# Altium project Capstone_SDR_PLUTOV2.PrjPcb (part 1 of 2)
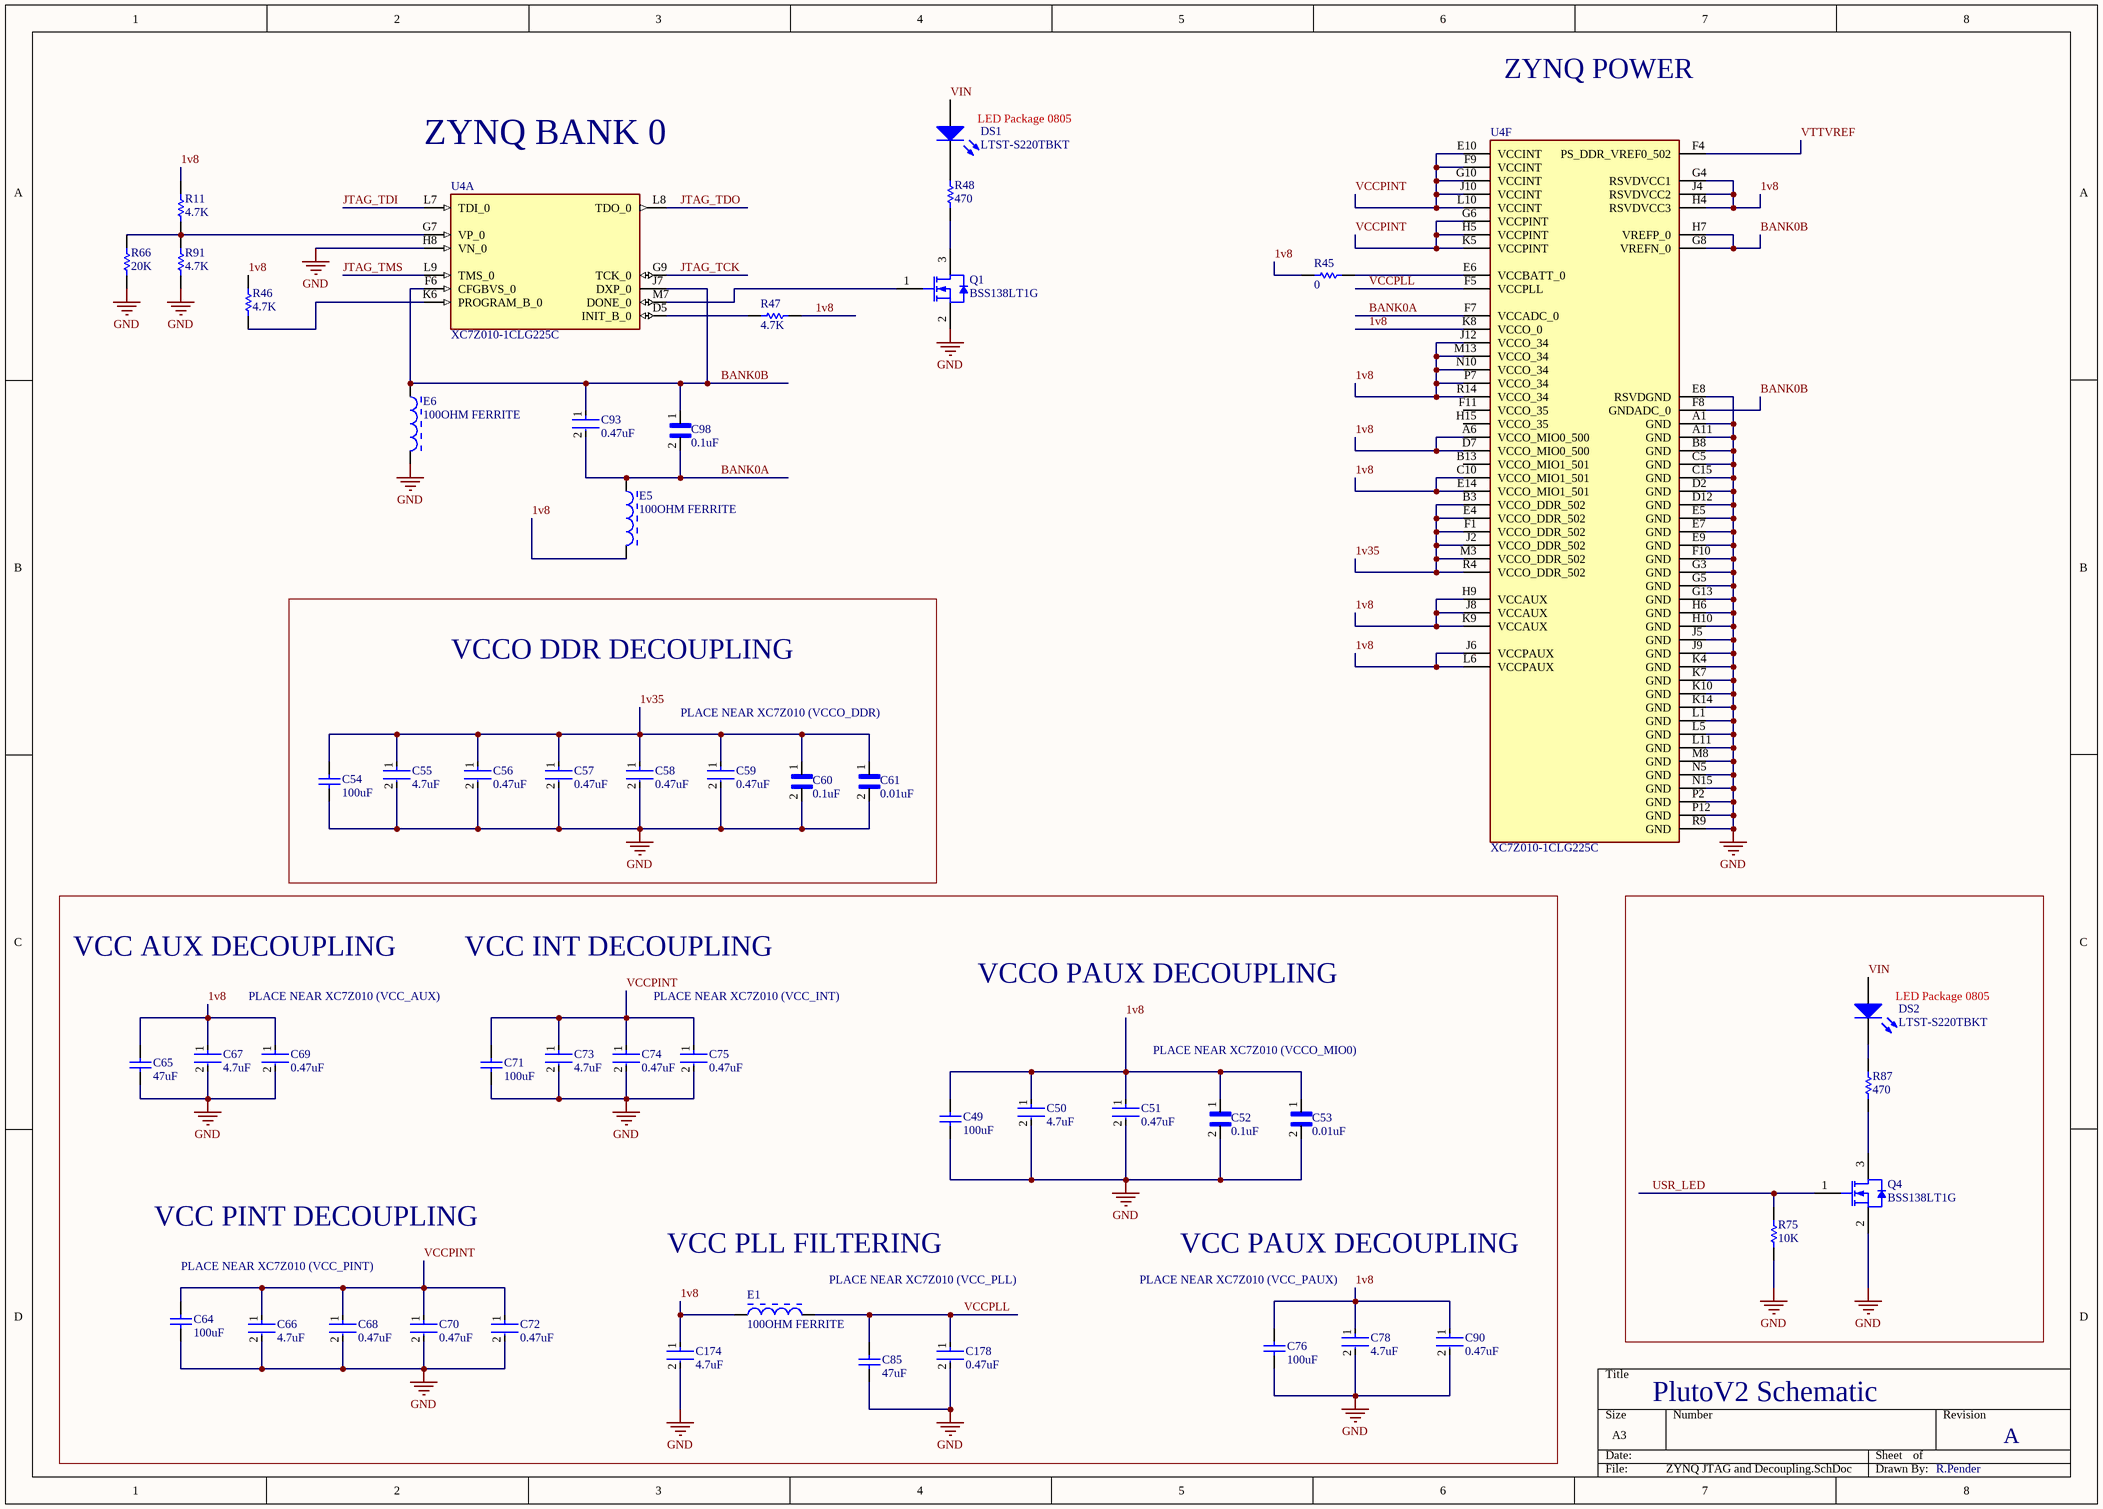
[diagram p0: ZYNQ JTAG and Decoupling.SchDoc]
7 sheets, 240 parts. Net scope: global (net labels, ports and power ports of the same name join across sheets).
Board file: PlutoV2_PCB.PcbDoc
Sheets:
  ZYNQ JTAG and Decoupling.SchDoc
  RF FRONTEND.SchDoc
  CONNECTORS_SELECTORS.SchDoc
  POWERMANAGE.SchDoc
  POWERMANAGE2.SchDoc
  TESTPOINTS.SchDoc
  RF Frontend 2.SchDoc

## Sheet ZYNQ JTAG and Decoupling.SchDoc
size A3; SheetNumber: 4; SheetTotal: 13; SPICEModelCacheIAXUMUHC: <root> / <DocumentId>IAXUMUHC</DocumentId> / <CacheFrame Number="0"> / <Model Name="led3" Kind="MDL"> / <Text>*Typ BLUE SiC LED: Vf=3.4V Vr=5V If=40mA trr=3uS / *LED Pinout: 1=A, 2=K / .MODEL LED3 D (IS=93.1P RS=42M N=7.47 BV=5 IBV=30U / + CJO=2.97P VJ=.75 M=.333 TT=4.32U)</Text> / </Model> / </CacheFrame> / </root>

### Parts
C49  100uF  [CAPC3216X190X55ML30T25]
C50  4.7uF  [FP-C1005-050-0_15-MFG]
C51  0.47uF  [FP-C1005-050-0_15-MFG]
C52  0.1uF  [CAPC0603X33N]
C53  0.01uF  [CAPC0603X33N]
C54  100uF  [CAPC3216X190X55ML30T25]
C55  4.7uF  [FP-C1005-050-0_15-MFG]
C56  0.47uF  [FP-C1005-050-0_15-MFG]
C57  0.47uF  [FP-C1005-050-0_15-MFG]
C58  0.47uF  [FP-C1005-050-0_15-MFG]
C59  0.47uF  [FP-C1005-050-0_15-MFG]
C60  0.1uF  [CAPC0603X33N]
C61  0.01uF  [CAPC0603X33N]
C64  100uF  [CAPC3216X190X55LL30T25]
C65  47uF  [TAYO-JMK212BBJ476MG-T_L]
C66  4.7uF  [FP-C1005-050-0_15-MFG]
C67  4.7uF  [FP-C1005-050-0_15-MFG]
C68  0.47uF  [FP-C1005-050-0_15-MFG]
C69  0.47uF  [FP-C1005-050-0_15-MFG]
C70  0.47uF  [FP-C1005-050-0_15-MFG]
C71  100uF  [CAPC3216X190X55LL30T25]
C72  0.47uF  [FP-C1005-050-0_15-MFG]
C73  4.7uF  [FP-C1005-050-0_15-MFG]
C74  0.47uF  [FP-C1005-050-0_15-MFG]
C75  0.47uF  [FP-C1005-050-0_15-MFG]
C76  100uF  [CAPC3216X190X55LL30T25]
C78  4.7uF  [FP-C1005-050-0_15-MFG]
C85  47uF  [TAYO-JMK212BBJ476MG-T_L]
C90  0.47uF  [FP-C1005-050-0_15-MFG]
C93  0.47uF  [FP-C1005-050-0_15-MFG]
C98  0.1uF  [CAPC0603X33N]
C174  4.7uF  [FP-C1005-050-0_15-MFG]
C178  0.47uF  [FP-C1005-050-0_15-MFG]
DS1  LTST-S220TBKT  [CAPC2012X135N]
DS2  LTST-S220TBKT  [CAPC2012X135N]
E1  100OHM FERRITE  [TDK-MPZ2012S101A-2_V]
E5  100OHM FERRITE  [TDK-MPZ2012S101A-2_V]
E6  100OHM FERRITE  [TDK-MPZ2012S101A-2_V]
Q1  BSS138LT1G  [ONSC-SOT-23-3-318-08_V]
Q4  BSS138LT1G  [ONSC-SOT-23-3-318-08_V]
R11  4.7K  [2-0402]
R45  0  [RESC1005X40X25ML10T10]
R46  4.7K  [2-0402]
R47  4.7K  [2-0402]
R48  470  [2-0402]
R66  20K  [2-0402]
R75  10K  [2-0402]
R87  470  [2-0402]
R91  4.7K  [2-0402]
U4  XC7Z010-1CLG225C  [BGA225C80P15X15_1300X1300X150]  (parts A,F of 6)

### Blocks framed on the sheet
VCCO DDR DECOUPLING: C54-C61
LED Package 0805: DS2 Q4 R75 R87

### Nets
GND: C49.2 C50.2 C51.2 C52.2 C53.2 C54.1 C55.2 C56.2 C57.2 C58.2 C59.2 C60.2 C61.2 C64.1 C65.2 C66.2 C67.2 C68.2 C69.2 C70.2 C71.1 C72.2 C73.2 C74.2 C75.2 C76.2 C78.2 C85.1 C90.2 C174.2 C178.2 E6.2 Q1.2(S) Q4.2(S) R66.2 R75.2 R91.2 U4.A1(GND) U4.A11(GND) U4.B8(GND) U4.C5(GND) U4.C15(GND) U4.D2(GND) U4.D12(GND) U4.E5(GND) U4.E7(GND) U4.E8(RSVDGND) U4.E9(GND) U4.F10(GND) U4.G3(GND) U4.G5(GND) U4.G13(GND) U4.H6(GND) U4.H8(VN_0) U4.H10(GND) U4.J5(GND) U4.J9(GND) U4.K4(GND) U4.K7(GND) U4.K10(GND) U4.K14(GND) U4.L1(GND) U4.L5(GND) U4.L11(GND) U4.M8(GND) U4.N5(GND) U4.N15(GND) U4.P2(GND) U4.P12(GND) U4.R9(GND)
1v8: C49.1 C50.1 C51.1 C52.1 C53.1 C65.1 C67.1 C69.1 C76.1 C78.1 C90.1 C174.1 E1.1 E5.2 R11.1 R45.1 R46.1 R47.1 U4.A6(VCCO_MIO0_500) U4.C10(VCCO_MIO1_501) U4.D7(VCCO_MIO0_500) U4.E14(VCCO_MIO1_501) U4.G4(RSVDVCC1) U4.H4(RSVDVCC3) U4.H9(VCCAUX) U4.J4(RSVDVCC2) U4.J6(VCCPAUX) U4.J8(VCCAUX) U4.J12(VCCO_34) U4.K8(VCCO_0) U4.K9(VCCAUX) U4.L6(VCCPAUX) U4.M13(VCCO_34) U4.N10(VCCO_34) U4.P7(VCCO_34) U4.R14(VCCO_34)
1v35: C54.2 C55.1 C56.1 C57.1 C58.1 C59.1 C60.1 C61.1 U4.B3(VCCO_DDR_502) U4.E4(VCCO_DDR_502) U4.F1(VCCO_DDR_502) U4.J2(VCCO_DDR_502) U4.M3(VCCO_DDR_502) U4.R4(VCCO_DDR_502)
BANK0A: C93.2 C98.2 E5.1 U4.F7(VCCADC_0)
BANK0B: C93.1 C98.1 E6.1 U4.F6(CFGBVS_0) U4.F8(GNDADC_0) U4.G8(VREFN_0) U4.H7(VREFP_0) U4.J7(DXP_0)
JTAG_TCK: U4.G9(TCK_0)
JTAG_TDI: U4.L7(TDI_0)
JTAG_TDO: U4.L8(TDO_0)
JTAG_TMS: U4.L9(TMS_0)
USR_LED: Q4.1(G) R75.1
VCCPINT: C64.2 C66.1 C68.1 C70.1 C71.2 C72.1 C73.1 C74.1 C75.1 U4.E10(VCCINT) U4.F9(VCCINT) U4.G6(VCCPINT) U4.G10(VCCINT) U4.H5(VCCPINT) U4.J10(VCCINT) U4.K5(VCCPINT) U4.L10(VCCINT)
VCCPLL: C85.2 C178.1 E1.2 U4.F5(VCCPLL)
VIN: DS1.1(A) DS2.1(A)
VTTVREF: U4.F4(PS_DDR_VREF0_502)
NetDS1_2: DS1.2(K) R48.1
NetDS2_2: DS2.2(K) R87.1
NetQ1_1: Q1.1(G) U4.M7(DONE_0)
NetQ1_3: Q1.3(D) R48.2
NetQ4_3: Q4.3(D) R87.2
NetR11_2: R11.2 R66.1 R91.1 U4.G7(VP_0)
NetR45_2: R45.2 U4.E6(VCCBATT_0)
NetR46_2: R46.2 U4.K6(PROGRAM_B_0)
NetR47_2: R47.2 U4.D5(INIT_B_0)

Not connected (* = marked no-connect by the designer): U4 B13(VCCO_MIO1_501) F11(VCCO_35) H15(VCCO_35)

### Notes on the sheet
- ZYNQ POWER
- ZYNQ BANK 0
- (near DS1) LED Package 0805
- PLACE NEAR XC7Z010 (VCCO_DDR)
- VCC AUX DECOUPLING
- VCC INT DECOUPLING
- VCCO PAUX DECOUPLING
- PLACE NEAR XC7Z010 (VCC_AUX)
- PLACE NEAR XC7Z010 (VCC_INT)
- PLACE NEAR XC7Z010 (VCCO_MIO0)
- VCC PINT DECOUPLING
- VCC PLL FILTERING
- VCC PAUX DECOUPLING
- PLACE NEAR XC7Z010 (VCC_PINT)
- (near E1) PLACE NEAR XC7Z010 (VCC_PLL)
- PLACE NEAR XC7Z010 (VCC_PAUX)
- PlutoV2 Schematic
- A
- R.Pender

### Library data of the parts
C49 C54 C64 C71 C76 = CMP-1662-00011-2: Chip Capacitor, 100 uF, +/- 20%, 6.3 V, -55 to 85 degC, 1206 (3216 Metric), RoHS, Tape and Reel; PartNumber: GRM31CR60J107ME39L; Case\/Package: 1206; Voltage Rating (DC): 6.3 V; Type (Capacitors): X5R; REACH SVHC: No SVHC; Height: 1.6 mm; Tolerance: 20%; Packaging: Tape and Reel; Mount: Surface Mount; PackageDescription: 2-Pin Surface Mount Device, Body 3.2 x 1.6 mm; ComponentLink1URL: http://www.murata.com/; Pins: 2; ComponentLink2Description: Datasheet; PackageReference: 1206; Width: 1.6 mm; Package Quantity: 2000; Capacitance: 100 uF; Min Operating Temperature: -55 degC; Case Code (Imperial): 1206; Max Operating Temperature: 85 degC; DatasheetVersion: 09/2016; Mounting Technology: Surface Mount; Voltage Rating: 6.3 V; ComponentLink1Description: Manufacturer URL; Radiation Hardening: No; Case Code (Metric): 3216; Length: 3.2 mm; ComponentLink2URL: http://psearch.en.murata.com/capacitor/product/GRM31CR60J107ME39%23.pdf; RoHSCompliant: true
C50 C51 C55-C59 C66-C70 C72-C75 C78 C90 C93 C174 C178 = CMP-2000-05437-2: CAP CER 4.7UF 6.3V X5R 0402; Tolerance: 10%; Dielectric Material: Ceramic; Voltage: 6.3V; Capacitance: 4.7uF; Depth: 0.5mm; Height: 0.5mm; Length: 1mm; Termination: SMD/SMT; RoHS Compliant: Yes; Series: C; Case/Package: 0402; Dielectric: X5R; Lead Free: Lead Free; Mount: Surface Mount; Max Operating Temperature: 85°C; Min Operating Temperature: -55°C
C52 C60 C98 = GRM033R61C104ME84D: CAP 0.1UF 16VDC X5R 20% SMD 0201 PAPER TAPE; Package: None; Price: None; Value: *; MP: GRM033R61C104ME84D; Availability: Unavailable
C53 C61 = GRM033R71A103KA01D: SMD Capacitor X7R(EIA) with Capacitance: 10000pF Tol. 10%. Rated Voltage: 10Vdc; MF: Murata; Package: 0603 Taiyo Yuden; MP: GRM033R71A103KA01D; Value: *; SnapEDA_Link: https://www.snapeda.com/parts/GRM033R71A103KA01D/Murata/view-part/4379446/?ref=snap; Availability: Unavailable; Price: None; Check_prices: https://www.snapeda.com/parts/GRM033R71A103KA01D/Murata/view-part/4379446/?ref=eda
C65 C85 = CMP-2000-06498-1: High Value Multilayer Ceramic Capacitor, 47 uF, +/-20%, 6.3 V, -55 to 85 degC, 2-Pin SMD (0805), RoHS, Tape and Reel; Manufacturer: Taiyo Yuden; PCN Part Number: X5R,X7RDielectrics23/Jan/2008; Kits: 587-1797-KIT-ND-KITCAPCERHICAP0603&0805S; Temperature Coefficient: X5R; Tolerance: ±20%; Online Catalog: MSeries; Other Names: 587-1779-1; Capacitance: 47µF; Voltage - Rated: 6.3V; Catalog Drawings: xMKSeries_0805_1.25; Operating Temperature: -55°C~85°C; Mounting Technology: SurfaceMount; Package Reference: 0805; Features: -; Lead Spacing: -; Lead Style: -; Family: CeramicCapacitors; Size / Dimension: 0.079"Lx0.049"W(2.00mmx1.25mm); Package Description: 2-Pin SMD, Body 2.2 x 1.45 mm; Mounting Type: SurfaceMount,MLCC; Package / Case: 0805(2012Metric); Series: M; Category: Capacitors; Packaging: CutTape(CT); Datasheet Version: 10/2015; Datasheet URL: http://datasheet.octopart.com/JMK212BJ476MG-T-Taiyo-Yuden-datasheet-62109412.pdf; Manufacturer URL: http://www.t-yuden.com/; Ratings: -; Height - Seated (Max): -; Standard Package: 1; Thickness (Max): 0.053"(1.35mm); Applications: GeneralPurpose
DS1 DS2 = LED3: Typical BLUE SiC LED; Published: 8-Jun-2000; LatestRevisionDate: 17-Dec-2003; LatestRevisionNote: PCB Footprint replaced.; DatasheetVersion: 16-Apr-2002; PackageVersion: 16-Apr-2002; PackageReference: 3.5X2.8X1.9; Publisher: Altium Limited; PackageDescription: SM LED; 2 C-Bend Leads; Body 3.5 x 2.8 x 1.9 mm, inc leads (LxWxH typ)
E1 E5 E6 = CMP-2000-05399-1: Chip Bead for Power Line, 100 Ohm, +/- 25%, 4 A, -55 to 125 degC, 0805 (2012 Metric), RoHS, Tape and Reel; Manufacturer: TDK; Maximum DC Resistance: 20mOhms; Test Frequency: 100MHz; Impedance: 100Ohms; Case Width: 1.25mm; Case Length: 2mm; Maximum DC Current: 4A; Case Height: 0.85mm; Package Reference: MPZ2012S101A-2; RoHS: Details; Tolerance: 25%; Operating Temperature Range: -55Cto+125C; Datasheet Version: Jul-13; Dimensions: 1.25mmWx2mmLx0.85mmH; Product: FerriteChipBeads; Termination Style: SMD/SMT; Datasheet URL: http://www.farnell.com/datasheets/1750041.pdf; Factory Pack Quantity: 4000; Brand: TDK; Packaging: Reel; Package Description: 2-Pin Surface Mount Device, Body 2 x 1.25 mm; Product Category: EMIFilterBeads,Chips&Arrays; Manufacturer URL: http://www.tdk.com/; Package / Case: 0805(2012metric)
Q1 Q4 = CMP-1058-00767-1: Power MOSFET, 200 mA, 50 V, N-Channel, 3-Pin SOT-23, Pb-Free, Tape and Reel; Manufacturer: On Semiconductor; PD Max (W): 0.225; Coss Typ (pF): 12; V(BR)DSS Min (V): 50; VGS Max (V): 20; Channel Polarity: N Channel; Configuration: Single; VGS(th) Max (V): 1.5; Ciss Typ (pF): 40; Crss Typ (pF): 3.5; ID Max (A): 0.2; ComponentLink3Description: Package Specification; PackageDescription: 3-Pin Small Outline Transistor, Body 2.92 x 1.3 mm, Pitch 0.95 mm; PackageReference: SOT-23-3-318-08; RoHS: Pb-Free; Mounting Technology: Surface Mount; ComponentLink1Description: Manufacturer URL; ComponentLink2URL: http://www.onsemi.com/pub_link/Collateral/BSS138LT1-D.PDF; ComponentLink2Description: Datasheet; Packing: Tape and Reel; PackageVersion: Rev. AP, 11/2009; PartNumber: BSS138LT1G; Package Type: SOT-23-3; ComponentLink1URL: http://www.onsemi.com/; DatasheetVersion: Rev. 8; ComponentLink3URL: http://www.onsemi.cn/pub_link/Collateral/318-08.PDF
R11 R46 R47 R66 R75 R91 = ERJ2RK: Precision Thick Film Chip Resistor, 10 Ohm to 1M Ohm Range, 1% and 0.5% Tolerance, 0402 Size, 0.063 W; Published: 17-Dec-2003; LatestRevisionDate: 19-Mar-2004; LatestRevisionNote: Silkscreen size reduced.; PackageDocument: Mar-2003; PackageReference: 2-0402; Publisher: Altium Limited; Code_IPC: 1005 [0402]; ComponentLink1Description: Manufacturer Link; ComponentLink1URL: http://www.panasonic.com/industrial/components/resistive_products.htm; ComponentLink2Description: Datasheet; ComponentLink2URL: http://www.panasonic.com/industrial/components/pdf/AOA0000CE2.pdf
R45 = CMP-2002-05896-1: Part Number: MC00625W040210R; Manufacturer: Multicomp
R48 R87 = ERJ2GE: Thick Film Chip Resistor, 1 Ohm to 2.2M Ohm Range, 5% Tolerance, 0402 Size, 0.063 W; Note: If flow soldering, adjust pad width of PCB Footprint to 0.7 - 0.8 times the width of the resistor.; Published: 17-Dec-2003; LatestRevisionDate: 19-Mar-2004; LatestRevisionNote: Silkscreen size reduced.; PackageDocument: Mar-2003; PackageReference: 2-0402; Publisher: Altium Limited; Code_IPC: 1005 [0402]; ComponentLink1Description: Manufacturer Link; ComponentLink1URL: http://www.panasonic.com/industrial/components/resistive_products.htm; ComponentLink2Description: Datasheet; ComponentLink2URL: http://www.panasonic.com/industrial/components/pdf/AOA0000CE1.pdf
U4 = XC7Z010-1CLG225C: Dual ARMÂ® CortexÂ®-A9 MPCoreâ„¢ with CoreSightâ„¢ System On Chip _SOC_ IC ZynqÂ®-7000 Artixâ„¢-7 FPGA, 28K Logic Cells 667MHz 225-CSPBGA _13x13_; MF: Xilinx Inc.; Value: *; SnapEDA_Link: https://www.snapeda.com/parts/XC7Z010-1CLG225C/Xilinx%20Inc./view-part/45778/?ref=snap; Digi-Key_Part_Number: 122-1855-ND; Package: CSPBGA-225 Xilinx; Digi-Key_Purchase_URL: https://www.digikey.by/product-detail/en/xilinx-inc/XC7Z010-1CLG225C/122-1855-ND/3925788?utm_source=snapeda&utm_medium=aggregator&utm_campaign=symbol; MP: XC7Z010-1CLG225C

## Sheet RF FRONTEND.SchDoc
size A3; SheetNumber: 7; SheetTotal: 14
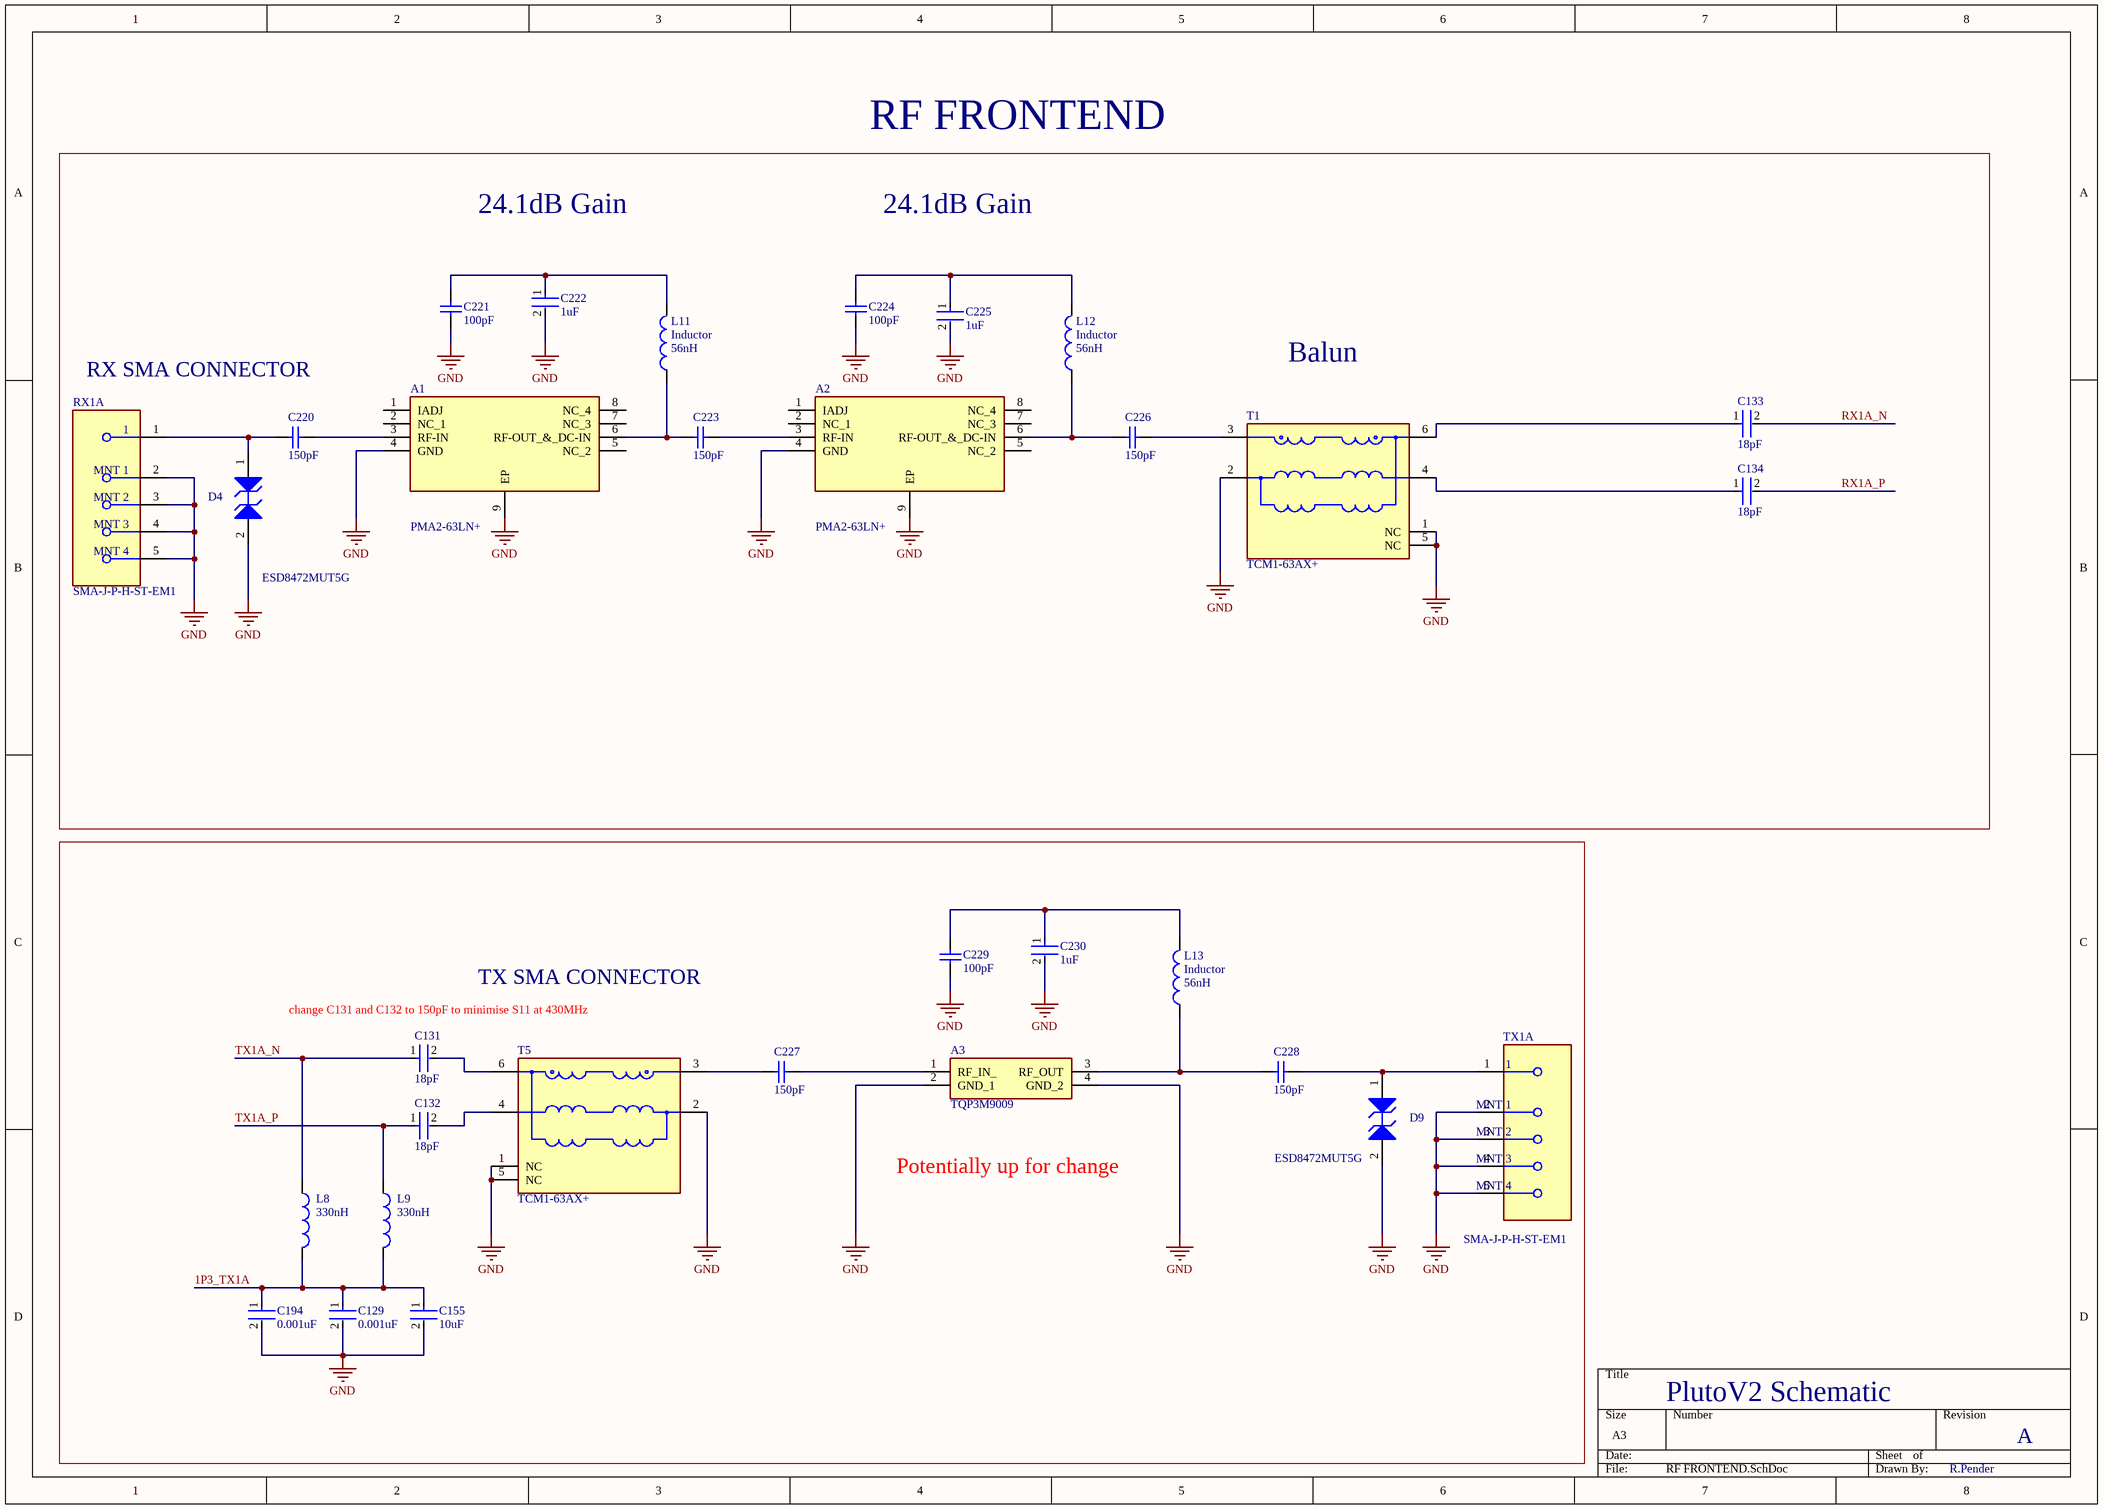
[diagram p1: RF FRONTEND.SchDoc]

### Parts
A1  PMA2-63LN+  [SON50P200X200X105-9N]
A2  PMA2-63LN+  [SON50P200X200X105-9N]
A3  TQP3M9009  [TQP3M9009]
C129  0.001uF  [FP-GRM033-0_03-MFG]
C131  18pF  [FP-GRM033-0_03-IPC_A]
C132  18pF  [FP-GRM033-0_03-IPC_A]
C133  18pF  [FP-GRM033-0_03-IPC_A]
C134  18pF  [FP-GRM033-0_03-IPC_A]
C155  10uF  [FP-GRM188-0_1-e0_2_0_55-IPC_C]
C194  0.001uF  [FP-GRM033-0_03-MFG]
C220  150pF  [CAPC1005X55X25ML05T10]
C221  100pF  [CAPC1005X55X25ML05T10]
C222  1uF  [FP-GRM155-0_05-IPC_B]
C223  150pF  [CAPC1005X55X25ML05T10]
C224  100pF  [CAPC1005X55X25ML05T10]
C225  1uF  [FP-GRM155-0_05-IPC_B]
C226  150pF  [CAPC1005X55X25LL05T10]
C227  150pF  [CAPC1005X55X25LL05T10]
C228  150pF  [CAPC1005X55X25LL05T10]
C229  100pF  [CAPC1005X55X25ML05T10]
C230  1uF  [FP-GRM155-0_05-IPC_B]
D4  ESD8472MUT5G  [ONSC-X3DFN-2-152AF-01_V]
D9  ESD8472MUT5G  [ONSC-X3DFN-2-152AF-01_V]
L8  330nH  [INDC2317X140N]
L9  330nH  [INDC2317X140N]
L11  Inductor  value 56nH  [0402-A]
L12  Inductor  value 56nH  [0402-A]
L13  Inductor  value 56nH  [0402-A]
RX1A  SMA-J-P-H-ST-EM1  [FP-SMA-J-P-H-ST-EM1-MFG]
T1  TCM1-63AX+  [FP-TCM1-63AX+-MFG]
T5  TCM1-63AX+  [FP-TCM1-63AX+-MFG]
TX1A  SMA-J-P-H-ST-EM1  [FP-SMA-J-P-H-ST-EM1-MFG]

### Blocks framed on the sheet
RF FRONTEND: A1 A2 C133 C134 C220-C226 D4 L11 L12 RX1A T1

### Nets
GND: A1.4(GND) A1.9(EP) A2.4(GND) A2.9(EP) A3.2(GND_1) A3.4(GND_2) C129.2 C155.2 C194.2 C221.2 C222.2 C224.2 C225.2 C229.2 C230.2 D4.2(A2) D9.2(A2) RX1A.2(MNT_1) RX1A.3(MNT_2) RX1A.4(MNT_3) RX1A.5(MNT_4) T1.1(NC) T1.2(GND) T1.5(NC) T5.1(NC) T5.2(GND) T5.5(NC) TX1A.2(MNT_1) TX1A.3(MNT_2) TX1A.4(MNT_3) TX1A.5(MNT_4)
1P3_TX1A: C129.1 C155.1 C194.1 L8.2 L9.2  [project net 1P3_SUPPLY_B]
RX1A_N: C133.2
RX1A_P: C134.2
TX1A_N: C131.1 L8.1
TX1A_P: C132.1 L9.1
NetA1_3: A1.3(RF-IN) C220.2
NetA1_6: A1.6(RF-OUT_&_DC-IN) C223.1 L11.1
NetA2_3: A2.3(RF-IN) C223.2
NetA2_6: A2.6(RF-OUT_&_DC-IN) C226.1 L12.1
NetA3_1: A3.1(RF_IN_) C227.2
NetA3_3: A3.3(RF_OUT) C228.1 L13.1
NetC131_2: C131.2 T5.6(SECONDARY_DOT)
NetC132_2: C132.2 T5.4(SECONDARY)
NetC133_1: C133.1 T1.6(SECONDARY_DOT)
NetC134_1: C134.1 T1.4(SECONDARY)
NetC220_1: C220.1 D4.1(A1) RX1A.1
NetC221_1: C221.1 C222.1 L11.2
NetC224_1: C224.1 C225.1 L12.2
NetC226_2: C226.2 T1.3(PRIMARY_DOT)
NetC227_1: C227.1 T5.3(PRIMARY_DOT)
NetC228_2: C228.2 D9.1(A1) TX1A.1
NetC229_1: C229.1 C230.1 L13.2

Not connected (* = marked no-connect by the designer): A1 1(IADJ) 2(NC_1) 5(NC_2) 7(NC_3) 8(NC_4); A2 1(IADJ) 2(NC_1) 5(NC_2) 7(NC_3) 8(NC_4)

### Notes on the sheet
- 24.1dB Gain
- RX SMA CONNECTOR
- Balun
- TX SMA CONNECTOR
- change C131 and C132 to 150pF to minimise S11 at 430MHz
- Potentially up for change
- PlutoV2 Schematic
- A
- R.Pender

### Library data of the parts
A1 A2 = PMA2-63LN+: Integrated Circuit; Manufacturer_Name: Mini-Circuits; Datasheet Link: https://www.minicircuits.com/pdfs/PMA2-63LN+.pdf; Height: 1.05mm; Manufacturer_Part_Number: PMA2-63LN+
A3 = TQP3M9009: Integrated Circuit; Manufacturer_Name: Qorvo; Datasheet Link: https://componentsearchengine.com/Datasheets/1/TQP3M9009.pdf; Height: 1.6mm; Manufacturer_Part_Number: TQP3M9009
C129 C194 = CMP-2010-01706-2: Chip Multilayer Ceramic Capacitors for General Purpose, 0201, 1000pF, X7R, 15%, 10%, 25V; Capacitance: 1nF; Max Operating Temperature: 125°C; Material: Ceramic; Lead Free: Lead Free; Radiation Hardening: No; Dielectric: X7R; Height: 0.3mm; Mount: Surface Mount; Packaging: Tape and Reel; Termination: SMD/SMT; Thickness: 0.013inch; Case Code (Metric): 0603; Tolerance: 10%; Voltage Rating (DC): 25V; REACH SVHC: No SVHC; Package Quantity: 1; Depth: 0.3mm; Voltage: 25V; Case/Package: 0201; Case Code (Imperial): 0201; Voltage Rating: 25V; Min Operating Temperature: -55°C; Length: 0.6mm; Width: 0.012inch
C131-C134 = CMP-2010-01507-2: Chip Multilayer Ceramic Capacitors for General Purpose, 0201, 18pF, C0G, 30ppm/°C, 5%, 50V; Max Operating Temperature: 125°C; Case Code (Metric): 0603; Case Code (Imperial): 0201; Capacitance: 18pF; Voltage Rating (DC): 50V; Lead Free: Lead Free; Mount: Surface Mount; Radiation Hardening: No; Height: 0.3mm; Package Quantity: 15000; Depth: 0.3mm; Tolerance: 5%; Thickness: 0.013inch; Width: 0.3mm; Packaging: Tape and Reel; Voltage Rating: 50V; Dielectric: C0G; Length: 0.6mm; Termination: SMD/SMT; Min Operating Temperature: -55°C; Case/Package: 0201; Voltage: 50V
C155 = CMP-2006-02792-2: Chip Multilayer Ceramic Capacitors for General Purpose, 0603, 10uF, X5R, 15%, 20%, 6.3V; Packaging: Tape and Reel; Voltage Rating (DC): 6.3V; Width: 0.031inch; Termination: SMD/SMT; Dielectric: X5R; Package Quantity: 4000; Voltage Rating: 6.3V; Capacitance: 10uF; Case/Package: 0603; Min Operating Temperature: -55°C; Voltage: 6.3V; Length: 1.6mm; Thickness: 0.035inch; Lead Free: Lead Free; Depth: 0.8mm; Case Code (Imperial): 0603; Max Operating Temperature: 85°C; Material: Ceramic; Height: 0.8mm; Tolerance: 20%; Mount: Surface Mount; REACH SVHC: No SVHC; Radiation Hardening: No; Case Code (Metric): 1608
C220 C223 C226-C228 = CMP-2008-04269-1: Manufacturer: Murata; Part Number: GRM1555C1H151JA01D
C221 C224 C229 = CMP-2008-03915-1: Manufacturer: Murata; Part Number: GRM1555C1H101JA01D
C222 C225 C230 = CMP-2008-04581-2: Chip Multilayer Ceramic Capacitors for General Purpose, 0402, 1.0uF, X5R, 15%, 10%, 25V; Height: 0.5mm; Voltage: 25V; Tolerance: 10%; Termination: SMD/SMT; Dielectric: X5R; REACH SVHC: No SVHC; Case Code (Imperial): 0402; Max Operating Temperature: 85°C; Lead Free: Lead Free; Case/Package: 0402; Mount: Surface Mount; Width: 0.5mm; Weight: 0.000212oz; Min Operating Temperature: -55°C; Voltage Rating (DC): 25V; Length: 1mm; Thickness: 0.022inch; Voltage Rating: 25V; Material: Ceramic; Case Code (Metric): 1005; Package Quantity: 10000; Packaging: Tape and Reel; Depth: 0.5mm; Capacitance: 1uF
D4 D9 = CMP-1063-00281-1: Ultra-Low Capacitance ESD Protection, Micro-Packaged Diode for ESD Protection, 2-Pin X3DFN, Pb-Free, Tape and Reel; Manufacturer: On Semiconductor; IR Max (uA): 0.05; C Max (pF): 0.3; V(BR) Min (V): 7; VRWM Max (V): 5.3; Number of Lines: 1; Direction: Bidirectional; PartNumber: ESD8472MUT5G; PackageVersion: Rev. O, 04/2011; RoHS: Pb-Free; PackageDescription: 2-Pin Small Outline No-Lead, Body 0.62 x 0.32 mm, Pitch 0.355 mm; ComponentLink1Description: Manufacturer URL; ComponentLink1URL: http://www.onsemi.com/; Packing: Tape and Reel; Mounting Technology: Surface Mount; PackageReference: X3DFN-2-152AF-01; ComponentLink3Description: Package Specification; ComponentLink2Description: Datasheet; ComponentLink3URL: http://www.onsemi.cn/pub_link/Collateral/152AF.PDF; DatasheetVersion: Rev. 4; ComponentLink2URL: http://www.onsemi.cn/pub_link/Collateral/ESD8472-D.PDF
L8 L9 = Inductor: Code_IEC: 1005; Value: 10mH; Published: 8-Jun-2000; LatestRevisionDate: 29-May-2009; LatestRevisionNote: IPC-7351 Footprint Added.; PackageReference: 0402-A; Publisher: Altium Limited; PackageDescription: Chip Inductor; Code_JEITA: 0402
L11-L13 = Inductor: Code_IEC: 1005; Published: 8-Jun-2000; LatestRevisionDate: 29-May-2009; LatestRevisionNote: IPC-7351 Footprint Added.; PackageReference: 0402-A; Publisher: Altium Limited; PackageDescription: Chip Inductor; Code_JEITA: 0402
RX1A TX1A = CMP-02754-000006-1: CONN SMA JACK STR 50OHM EDGE MNT; Dielectric Material: PTFE; Center Contact Plating: Gold; Max Frequency: 6GHz; Body Material: Brass; Voltage Rating: 335V; Impedance: 50R; Package Quantity: 1; Case/Package: SMA; Max Operating Temperature: 125°C; Fastening Type: Threaded; Orientation: Straight; Depth: 13.33mm; RoHS Compliant: Yes; Length: 6.35mm; Insulation Material: Polytetrafluoroethylene; Termination: Solder; Min Operating Temperature: -65°C; Housing Color: Gold; Contact Plating: Gold; Contact Material: Copper; Connector Type: SMA; Mount: Edge; Series: SMA; Packaging: Tray; Body Plating: Gold; Radiation Hardening: No
T1 T5 = CMP-199822-000001-1: 1:1 CORE & WIRE Transformer, 10 - 6000 MHz, 50Ω; Manufacturer: Mini-Circuits; Insertion Loss: 1.16-1.8dB; Return Loss: 9.42-16.9dB; Lead Free: Yes; Device Class L3: unset; Temperature: -40°C to +85°C; Manufacturer Part Number: TCM1-63AX+; Frequency: 10-6000MHz; Device Class L2: Transformers; RoHS: TRUE; Octopart: https://octopart.com/tcm1-63ax%2B-mini-circuits-107315723; Temperature Range Low: -40°C; Category: Trans; Package: 0; ComponentLink2URL: https://www.minicircuits.com/pdfs/TCM1-63AX+.pdf; ComponentLink2Description: Datasheet; Automotive: No; Height: 4.06mm; Device Class L1: Passive Components; Temperature Range High: +85°C; Turns Ratio: 1:1

## Sheet CONNECTORS_SELECTORS.SchDoc
size A3; SheetNumber: 8; SheetTotal: 14
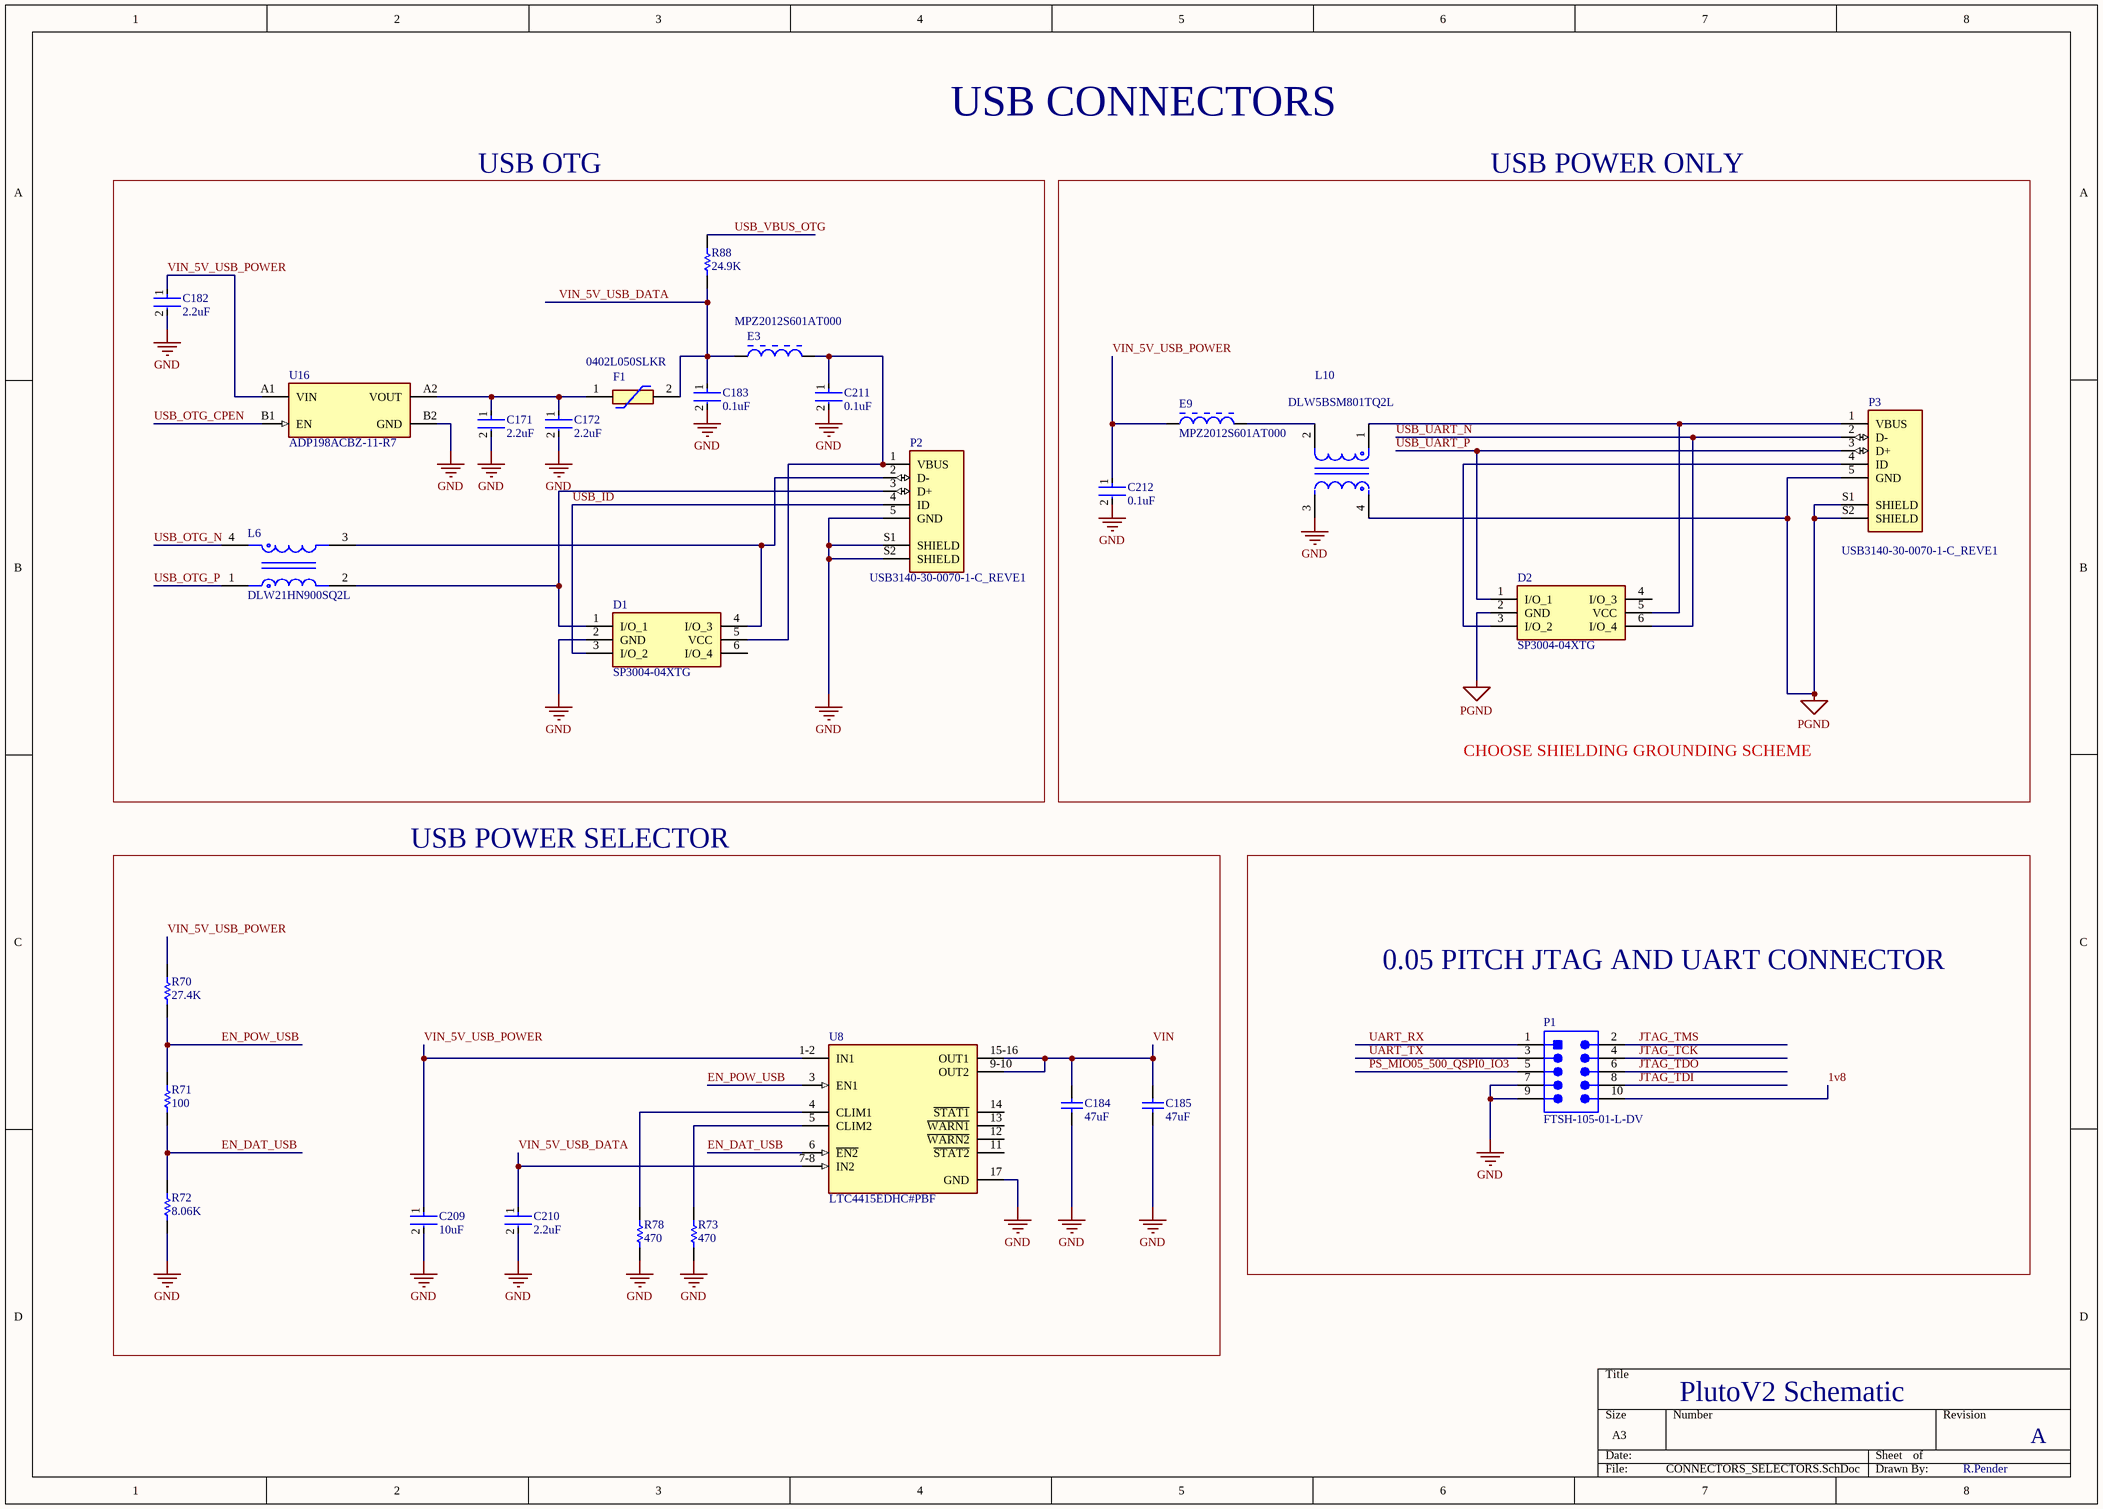
[diagram p2: CONNECTORS_SELECTORS.SchDoc]

### Parts
C171  2.2uF  [FP-GRM188-0_2-IPC_C]
C172  2.2uF  [FP-GRM188-0_2-IPC_C]
C182  2.2uF  [FP-GRM188-0_2-MFG]
C183  0.1uF  [FP-CL10-IPC_A]
C184  47uF  [TAYO-JMK212BBJ476MG-T_L]
C185  47uF  [TAYO-JMK212BBJ476MG-T_L]
C209  10uF  [FP-GRM188-0_15-MFG]
C210  2.2uF  [FP-GRM188-0_2-IPC_C]
C211  0.1uF  [FP-CL10-IPC_A]
C212  0.1uF  [FP-CL10-IPC_A]
D1  SP3004-04XTG  [SOTFL50P160X60-6N]
D2  SP3004-04XTG  [SOTFL50P160X60-6N]
E3  MPZ2012S601AT000  [TDK-MPZ2012_V]
E9  MPZ2012S601AT000  [TDK-MPZ2012_V]
F1  0402L050SLKR  [0402L010SLKR]
L6  DLW21HN900SQ2L  [FP-DLW21HN-MFG]
L10  DLW5BSM801TQ2L  [FP-DLW5BS-MFG]
P1  FTSH-105-01-L-DV  [SMTC-FTSH-105-01-L-DV_V]
P2  USB3140-30-0070-1-C_REVE1  [GCT_USB3140-30-0070-1-C_REVE1]
P3  USB3140-30-0070-1-C_REVE1  [GCT_USB3140-30-0070-1-C_REVE1]
R70  27.4K  [2-0402]
R71  100  [2-0402]
R72  8.06K  [2-0402]
R73  470  [RESC1005X40X25ML05T10]
R78  470  [RESC1005X40X25ML05T10]
R88  24.9K  [2-0402]
U8  LTC4415EDHC#PBF  [FP-DHC-16-05-08-1872-MFG]
U16  ADP198ACBZ-11-R7  [FP-CB-4-4-MFG]

### Blocks framed on the sheet
USB OTG: C171 C172 C182 C183 C211 D1 E3 F1 L6 P2 R88 U16
USB POWER ONLY: C212 D2 E9 L10 P3
USB POWER SELECTOR: C184 C185 C209 C210 R70-R73 R78 U8
0.05 PITCH JTAG AND UART CONNECTOR: P1

### Nets
GND: C171.2 C172.2 C182.2 C183.2 C184.2 C185.2 C209.2 C210.2 C211.2 C212.2 D1.2(GND) L10.3 P1.7 P1.9 P2.5(GND) P2.S1(SHIELD) P2.S2(SHIELD) R72.2 R73.2 R78.2 U8.17(GND) U16.B2(GND)
PGND: D2.2(GND) L10.4 P3.5(GND) P3.S1(SHIELD) P3.S2(SHIELD)
1v8: P1.10
EN_DAT_USB: R71.2 R72.1 U8.6(~{EN2})
EN_POW_USB: R70.2 R71.1 U8.3(EN1)
JTAG_TCK: P1.4
JTAG_TDI: P1.8
JTAG_TDO: P1.6
JTAG_TMS: P1.2
PS_MIO05_500_QSPI0_IO3: P1.5
UART_RX: P1.1
UART_TX: P1.3
USB_ID: D1.3(I/O_2) P2.4(ID)
USB_OTG_CPEN: U16.B1(EN)
USB_OTG_N: L6.4
USB_OTG_P: L6.1
USB_UART_N: D2.6(I/O_4) P3.2(D-)
USB_UART_P: D2.1(I/O_1) P3.3(D+)
USB_VBUS_OTG: R88.2
VIN: C184.1 C185.1 U8.9-10(OUT2) U8.15-16(OUT1)
VIN_5V_USB_DATA: C183.1 C210.1 E3.1 F1.2 R88.1 U8.7-8(IN2)
VIN_5V_USB_POWER: C182.1 C209.1 C212.1 E9.1 R70.1 U8.1-2(IN1) U16.A1(VIN)
NetC171_1: C171.1 C172.1 F1.1 U16.A2(VOUT)
NetC211_1: C211.1 D1.5(VCC) E3.2 P2.1(VBUS)
NetD1_1: D1.1(I/O_1) L6.2 P2.3(D+)
NetD1_4: D1.4(I/O_3) L6.3 P2.2(D-)
NetD2_3: D2.3(I/O_2) P3.4(ID)
NetD2_5: D2.5(VCC) L10.1 P3.1(VBUS)
NetE9_2: E9.2 L10.2
NetR73_1: R73.1 U8.5(CLIM2)
NetR78_1: R78.1 U8.4(CLIM1)

Not connected (* = marked no-connect by the designer): D1 6(I/O_4); D2 4(I/O_3); U8 11(~{STAT2}) 12(~{WARN2}) 13(~{WARN1}) 14(~{STAT1})

### Notes on the sheet
- USB CONNECTORS
- CHOOSE SHIELDING GROUNDING SCHEME
- PlutoV2 Schematic
- A
- R.Pender

### Library data of the parts
C171 C172 C182 C210 = CMP-06035-023692-1: Chip Multilayer Ceramic Capacitors for General Purpose, 0603, 2.2uF, X5R, 15%, 10%, 50V; Mount: Surface Mount; Case/Package: 0603; Voltage Rating (DC): 50V; Weight: 0.000222oz; Capacitance: 2.2uF; Max Operating Temperature: 85°C; Length: 0.063inch; Thickness: 0.039inch; Dielectric: X5R; Min Operating Temperature: -55°C; Termination: SMD/SMT; Resistor Type: Ceramic; Width: 0.8mm; Voltage Rating: 50V; Height: 0.8mm; Tolerance: 10%; Case Code (Metric): 1608; Package Quantity: 10000; Packaging: Tape and Reel; Case Code (Imperial): 0603
C183 C211 C212 = CMP-13271-004036-1: Cap Ceramic 100nF 100V X7R ±10% Pad SMD 0603 +125°C T/R; Mount: Surface Mount; Packaging: Cut Tape; Width: 0.031inch; Thickness: 0.035inch; Length: 0.063inch; Tolerance: 10%; Min Operating Temperature: -55°C; Case/Package: 0603; Voltage Rating: 100V; Max Operating Temperature: 125°C; Case Code (Metric): 1608; Capacitance: 100nF; Case Code (Imperial): 0603
C184 C185 = CMP-2000-06498-1: as C65 on sheet ZYNQ JTAG and Decoupling; Operating Temperature: -55°C~85°C; Mounting Technology: SurfaceMount; Package Reference: 0805; Features: -; Lead Spacing: -; Lead Style: -; Family: CeramicCapacitors; Size / Dimension: 0.079"Lx0.049"W(2.00mmx1.25mm); Package Description: 2-Pin SMD, Body 2.2 x 1.45 mm; Mounting Type: SurfaceMount,MLCC; Package / Case: 0805(2012Metric); Series: M; Category: Capacitors; Packaging: CutTape(CT); Datasheet Version: 10/2015; Datasheet URL: http://datasheet.octopart.com/JMK212BJ476MG-T-Taiyo-Yuden-datasheet-62109412.pdf; Manufacturer URL: http://www.t-yuden.com/; Ratings: -; Height - Seated (Max): -; Standard Package: 1; Thickness (Max): 0.053"(1.35mm); Applications: GeneralPurpose
C209 = CMP-06035-003612-1: Chip Multilayer Ceramic Capacitors for General Purpose, 0603, 10uF, X5R, 15%, 20%, 10V; Tolerance: 20%; Dielectric: X5R; Package Quantity: 4000; Width: 0.8mm; Case/Package: 0603; Thickness: 0.035inch; Capacitance: 10uF; Voltage Rating: 10V; Voltage Rating (DC): 10V; Termination: SMD/SMT; Length: 1.6mm; Lead Free: Lead Free; Mount: Surface Mount; Height: 0.8mm; Depth: 0.8mm; Packaging: Tape and Reel; Weight: 0.000222oz; Min Operating Temperature: -55°C; Case Code (Metric): 1608; Max Operating Temperature: 85°C; Case Code (Imperial): 0603; Material: Ceramic
D1 D2 = SP3004-04XTG: TVS Diode (Uni-directional); Manufacturer_Name: LITTELFUSE; Datasheet Link: https://m.littelfuse.com/~/media/electronics/datasheets/tvs_diode_arrays/littelfuse_tvs_diode_array_sp3004_datasheet.pdf.pdf; Height: 0.6mm; Manufacturer_Part_Number: SP3004-04XTG
E3 E9 = CMP-2000-05401-1: Chip Bead, 0.1 Ohm, 2 A, -55 to 125 degC, 2-Pin SMD (0805), RoHS, Tape and Reel; PCN Part Number: MMZ,MPSSeriesOct/2014; Manufacturer: TDK; Impedance @ Frequency: 600Ohm@100MHz; Other Names: 445-2206-6; Catalog Drawings: (MMZ,MPZ)2012SeriesTop / (MMZ,MPZ)2012SeriesFootprint / (MMZ,MPZ)2012SeriesSide; DC Resistance (DCR): 100mOhmMax; Current Rating: 2A; Product Training Modules: EMCComponents; Filter Type: DifferentialMode-Single; Online Catalog: MPZ2012Series; Datasheet URL: http://datasheet.octopart.com/MPZ2012S601AT000-TDK-datasheet-12512619.pdf; Size / Dimension: 0.079"Lx0.049"W(2.00mmx1.25mm); Package Reference: 805; Package / Case: 0805(2012Metric); Packaging: Digi-Reel; Mounting Type: SurfaceMount; Family: FerriteBeadsandChips; Category: Filters; Height (Max): 0.041"(1.05mm); Datasheet Version: Sep-12; Manufacturer URL: http://www.tdk.com/; Series: MPZ; Package Description: 2-Pin Surface Mount Device, Body 2 x 1.25 mm; Standard Package: 1
F1 = 0402L050SLKR: Resettable Fuse; Manufacturer_Name: LITTELFUSE; Datasheet Link: https://g.componentsearchengine.com/Datasheets/1/0402L010SLKR.pdf; Height: 0.6mm; Manufacturer_Part_Number: 0402L050SLKR
L6 = CMP-06045-000050-1: CMC 330MA 2LN 90 OHM SMD; Tolerance: 25%; Frequency: 100MHz; Shielding: Unshielded; Impedance: 90R; Number of Lines: 2; DC Resistance (DCR): 350mR; Voltage Rating: 50V; DC Current: 330mA; Current Rating: 330mA; Lead Free: Lead Free; Length: 2mm; Radiation Hardening: No; Max Operating Temperature: 85°C; Depth: 1.2mm; Weight: 0.000317oz; Height: 0.9mm; Termination: SMD/SMT; Min Operating Temperature: -40°C; Case/Package: 0805; Packaging: Tape and Reel; Width: 0.047inch; Test Frequency: 100MHz; Mount: Surface Mount; Current: 330mA; Military Standard: Not; Package Quantity: 1; Resistor Type: Wirewound; Case Code (Imperial): 0805; Max DC Current: 330mA
L10 = CMP-06045-000287-1: Common Mode Choke, 2020, 800Ω @ 100MHz, 0.056Ω, 40%, 2A; Number of Lines: 2; Impedance: 800R; DC Resistance (DCR): 56mR; Voltage Rating (DC): 50V; Tolerance: 40%; Package Quantity: 400; Max Current Rating: 2A; Termination: Wire; Max Operating Temperature: 105°C; Height: 0.197inch; Width: 5mm; Mount: Surface Mount; Case/Package: 2020; Weight: 0.010582oz; Length: 5mm; Max DC Current: 2A; Min Operating Temperature: -40°C; Packaging: Tape and Reel
P1 = CMP-2000-05354-1: Male Header, Pitch 1.27 mm, 2 x 5 Position, Height 5.96 mm, -55 to 125 degC, RoHS, Bulk; Manufacturer: Samtec; Connector Type: Header,Unshrouded; Pitch: 0.050"(1.27mm); Mating Products: FLE-105-01-G-DV-TR-ND-CONNSKT1.27MM10POSDUALSMDCLP-105-02-G-D-P-TR-ND-CONNRCPT10POSDUAL.05"SMDSFMC-105-L2-S-D-TR-ND-CONN.05"SURFACE10POSSMTSFMH-105-02-L-D-TR-ND-CONNRECEPT10POS.50"SMTFLE-105-01-G-DV-A-ND-CONNSKT1.27MM10POSDUALSMDCLP-105-02-G-D-BE-ND-CONNRCPT10POSDUAL.05"SMDFLE-105-01-G-DV-A-P-ND-CONNSKT1.27MM10POSDUALSMDSAM1153-05-ND-CONNRCPT10POSDUAL.05"SMDSAM1155-05-ND-CONNRCPT10POSDUAL.05"SMDSAM1154-05-ND-CONNRCPT10POSDUAL.05"SMDSFMH-105-02-L-D-LC-ND-CONNRECEPT10POS.50"SMTSAM1226-05-ND-CONNRCPT.05"10POSDUALSMD; Catalog Drawings: FTSHSeriesFTSHSeriesSMTSide; Other Names: SAM1161-05; EDA / CAD Models: DownloadfromAcceleratedDesigns; Number of Positions Loaded: All; Number of Positions: 10; Featured Product: Board-To-BoardInterconnectSystems; Online Catalog: FTSHSeries; Product Training Modules: Board-to-BoardConnectors; Category: Connectors,Interconnects; Number of Rows: 2; Contact Finish: Gold; Termination: Solder; Mounting Type: SurfaceMount; Series: FTSH; Contact Mating Length: 0.120"(3.05mm); Row Spacing: 0.050"(1.27mm); Datasheet URL: https://datasheet.ciiva.com/30493/0900766b80adfe36-30493006.pdf; Contact Finish Thickness: 10µin(0.25µm); Features: -; Standard Package: 1; Packaging: Bulk; Datasheet Version: Feb-08; Manufacturer URL: http://www.samtec.com/; Fastening Type: -; Family: RectangularConnectors-Headers,MalePins; Contact Type: MalePin; Color: Black
P2 P3 = USB3140-30-0070-1-C_REVE1: USB-micro B Ñ€Ð°Ð·ÑŠÐµÐ¼ Ñ€Ð¾Ð·ÐµÑ‚ÐºÐ¸ USB 2.0 5-Ð¿Ð¾Ð·Ð¸Ñ†Ð¸Ð¾Ð½Ð½Ð¾Ðµ Ð¿Ð¾Ð²ÐµÑ€Ñ…Ð½Ð¾ÑÑ‚Ð½Ð¾Ðµ ÐºÑ€ÐµÐ¿Ð»ÐµÐ½Ð¸Ðµ, ÑÐºÐ²Ð¾Ð·Ð½Ð¾Ðµ Ð¾Ñ‚Ð²ÐµÑ€ÑÑ‚Ð¸Ðµ; MF: Global Connector Technology; SnapEDA_Link: https://www.snapeda.com/parts/USB3140-30-0070-1-C/Global%20Connector%20Technology/view-part/697013/?ref=snap; Availability: Warning; Price: None; Package: None; Check_prices: https://www.snapeda.com/parts/USB3140-30-0070-1-C/Global%20Connector%20Technology/view-part/697013/?ref=eda; Purchase-URL: https://pricing.snapeda.com/search/part/USB3140-30-0070-1-C/?ref=eda; Value: *; MP: USB3140-30-0070-1-C
R70-R72 R88 = ERJ2RK: as R11 on sheet ZYNQ JTAG and Decoupling; Published: 17-Dec-2003; LatestRevisionDate: 19-Mar-2004; LatestRevisionNote: Silkscreen size reduced.; PackageDocument: Mar-2003; PackageReference: 2-0402; Publisher: Altium Limited; Code_IPC: 1005 [0402]; ComponentLink1Description: Manufacturer Link; ComponentLink1URL: http://www.panasonic.com/industrial/components/resistive_products.htm; ComponentLink2Description: Datasheet; ComponentLink2URL: http://www.panasonic.com/industrial/components/pdf/AOA0000CE2.pdf
R73 R78 = CMP-2002-07697-1: Part Number: RC0402FR-07470RL; Manufacturer: Yageo / Phycomp
U8 = CMP-0479-00072-2: IC OR CTRLR SRC SELECT 16DFN; Max Output Current: 4A; Operating Supply Current: 44uA; Packaging: Rail/Tube; Max Operating Temperature: 125°C; Min Operating Temperature: -40°C; Number of Pins: 16; Length: 5mm; Package Quantity: 73; Radiation Hardening: No; Series: PowerPath™; RoHS Compliant: Yes; Case/Package: DFN EP; Lead Free: Lead Free
U16 = CMP-09134-000005-1: IC PWR SWITCH P-CHAN 1:1 4WLCSP; Output Configuration: High Side; On-State Resistance: 40mR; Max Input Voltage: 6.5V; Fault Protection: Reverse Current; Min Input Voltage: 1.65V; Output Current per Channel: 1A; Interface: On/Off; Number of Outputs: 1; Operating Supply Current: 1.1uA; Min Operating Temperature: -40°C; Mount: Surface Mount; Lead Free: Contains Lead; Packaging: Tape and Reel; Max Operating Temperature: 85°C; Package Quantity: 3000; RoHS Compliant: Yes; Operating Supply Voltage: 6.5V; Series: -; Output Current: 1A; Number of Pins: 4; Max Output Current: 1A

## Sheet POWERMANAGE.SchDoc
size A3; SheetNumber: 10; SheetTotal: 13; SPICEModelCacheCHAYJENF: <root> / <DocumentId>CHAYJENF</DocumentId> / <CacheFrame Number="0"> / <Model Name="emk105bj105_v-f" Kind="CKT"> / <Text>* EMK105BJ105_V-F     SPICE MODEL  ( General Type ) / *-------------------------------------------------------------------------------------------------------- / * Model Generated by TAIYO YUDEN Corporation (http://www.ty-top.com) / * Version 1.0 / * TAIYO YUDEN Control No. 170508_130520 / * Copyright(c) 2012 TAIYO YUDEN CO.,LTD. All Rights Reserved. / *-------------------------------------------------------------------------------------------------------- / * / * Products Name : Multilayer Ceramic Capacitors / * / * Characteristics : / *     Capacitance : 1 uF , Rated Voltage : 16V , TCC : X5R / *     Case Size : 1.0 x 0.5 / 0.039 x 0.02 [mm/inch] , Thickness : 0.5 / 0.02 [mm/inch] / *     (Conditions: Temperature = 25 degC , DC Bias Current/Voltage = 0A / 0V) / * / * Frequency Range : 40Hz - 3GHz / * / * External Node Assignments : / * / *  1  o---| |---o  2 / * / *-------------------------------------------------------------------------------------------------------- / .SubCkt EMK105BJ105_V-F 1 2 / **************************** / C0 1 110 0.68309u / Cm 1 101 0.26053u / C1 101 102 0.94076u / Rc1 101 102 1.9029k / C2 102 103 0.66707u / Rc2 102 103 120.36 / C3 103 110 0.57203u / Rc3 103 110 2.1097 / C2m 1 301 0.1871u / C21 301 302 3.2494u / Rc21 301 302 1.1117k / C22 302 303 2.1014u / Rc22 302 303 1.484k / C23 303 304 2.1172u / Rc23 303 304 1.3876k / C24 304 305 0.75729u / Rc24 304 305 332.59 / C25 305 306 0.94401u / Rc25 305 306 249.09 / C26 306 307 0.34674u / Rc26 306 307 28.352 / C27 307 308 0.37158u / Rc27 307 308 19.989 / C28 308 309 0.17933u / Rc28 308 309 31.748 / C29 309 110 0.016445u / Rc29 309 110 1.0592 / Rp0 1 110 100Meg / L0 110 120 0.2216n / Lm 120 130 0.1509n / L1 120 121 0.12659n / RL1 121 130 0.85161 / L2 120 122 0.15996n / RL2 122 130 0.42469 / L3 120 123 7.9543n / RL3 123 130 0.54643m / CR 120 124 0.24334u / LR 124 125 0.090738n / RR 125 130 68.076m / CL 130 140 2.7354p / LL 130 140 0.10762n / RL 130 140 50.614 / Rs 140 2 7.5416m / **************************** / .ends EMK105BJ105_V-F</Text> / </Model> / </CacheFrame> / </root>
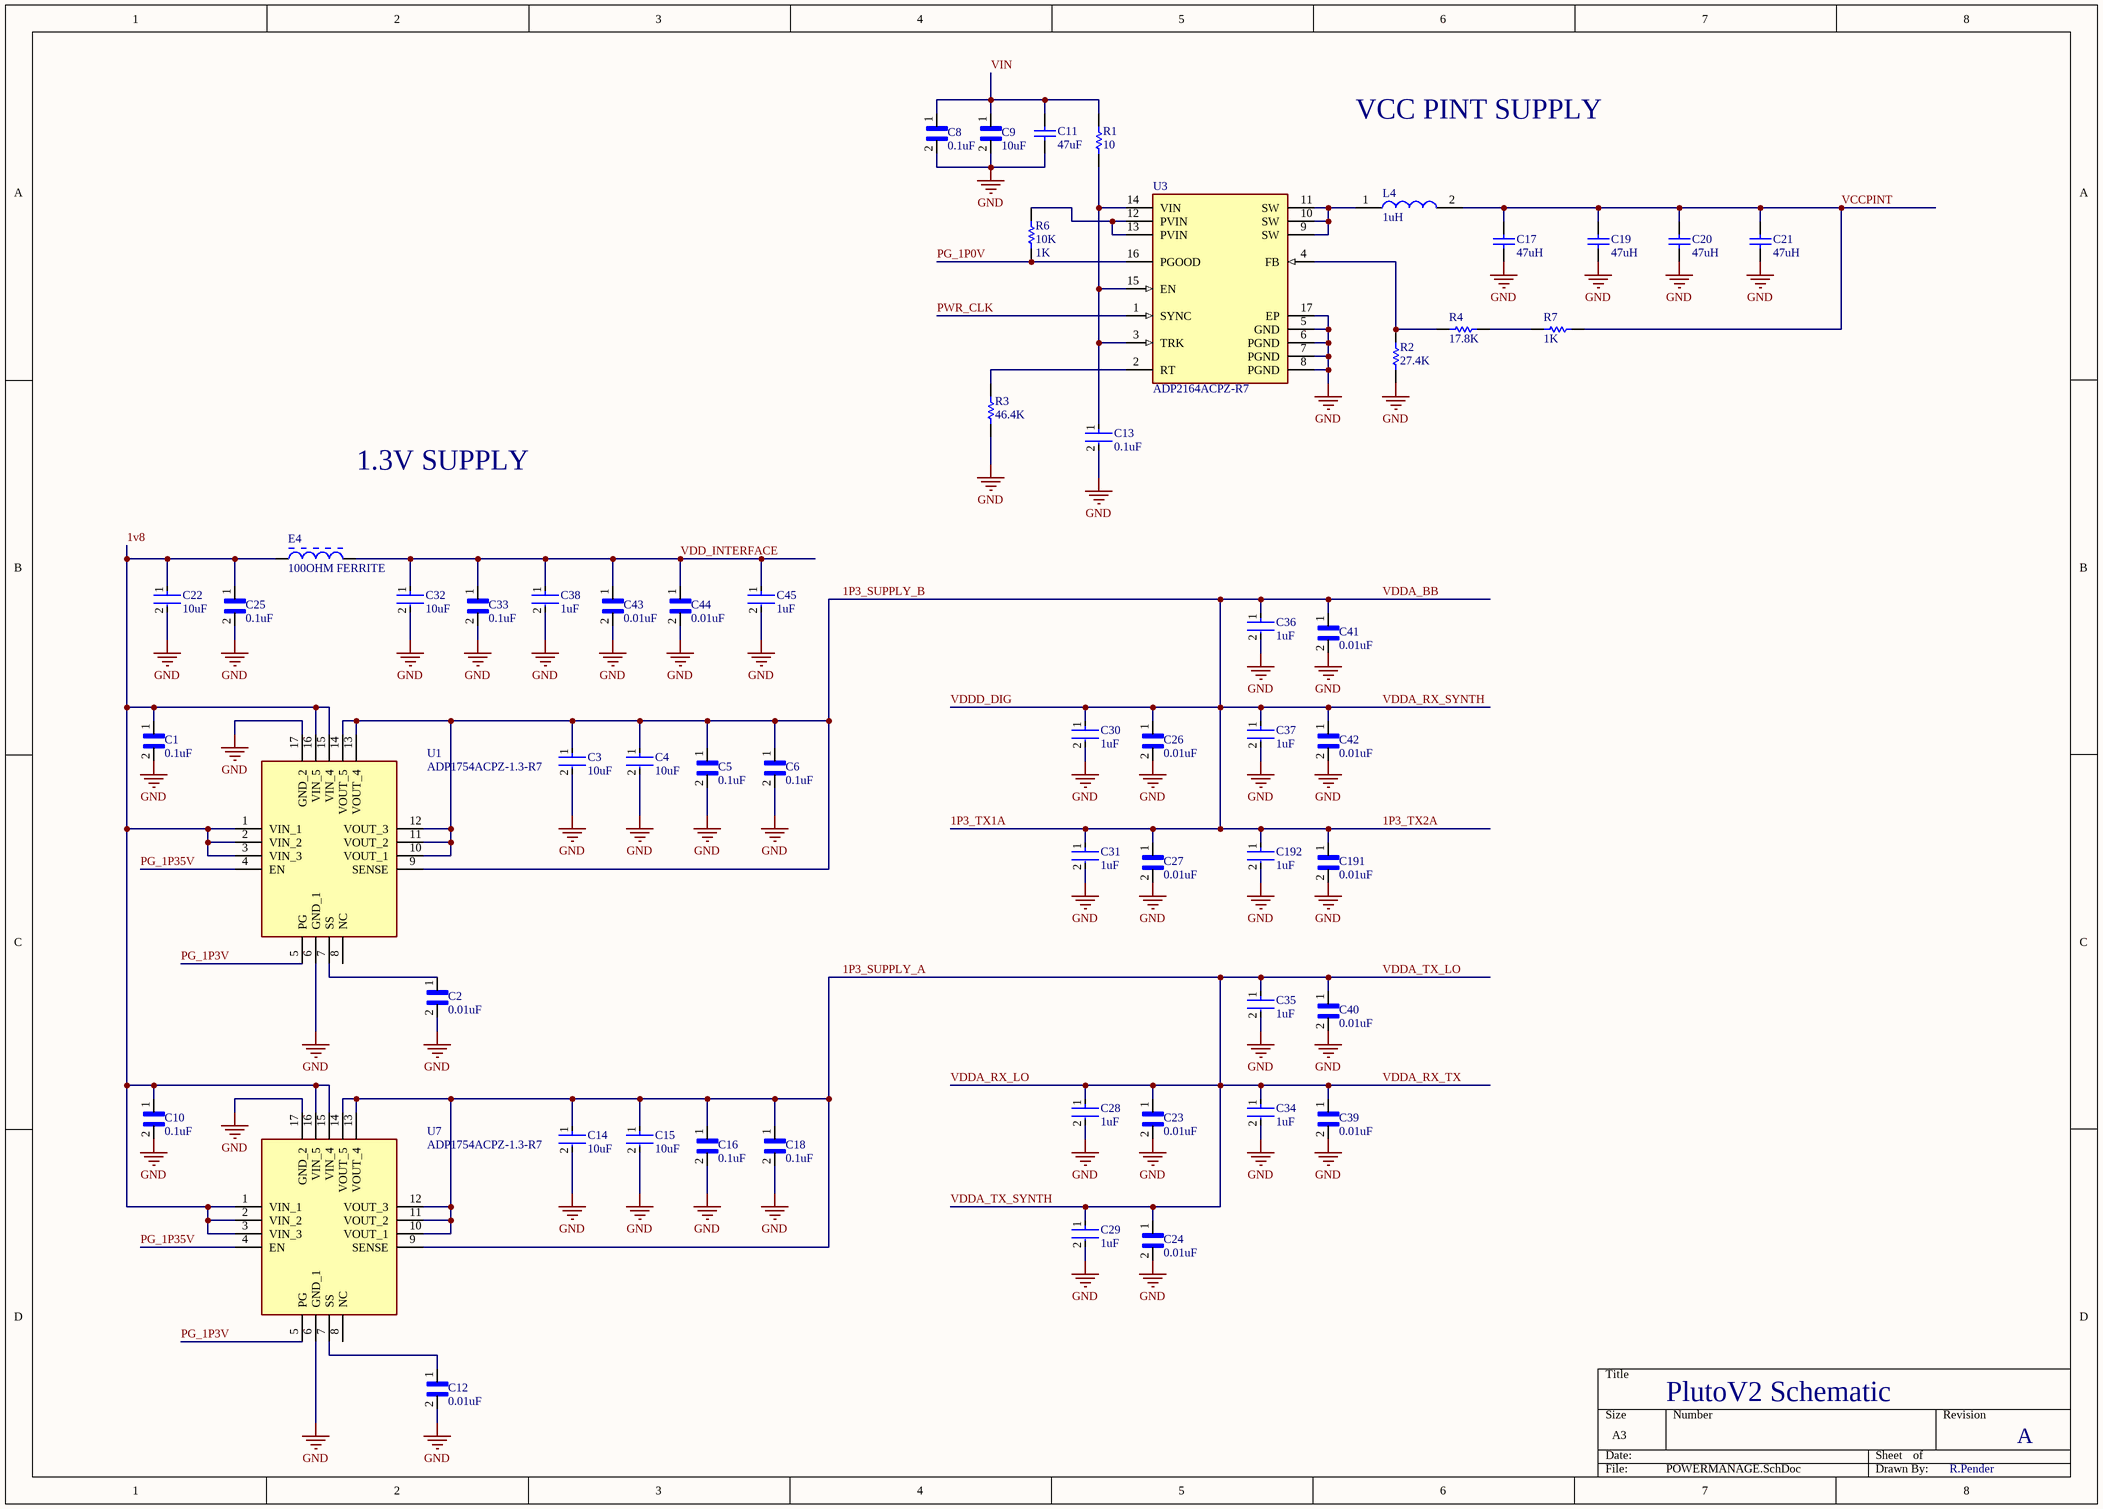
[diagram p3: POWERMANAGE.SchDoc]

### Parts
C1  0.1uF  [CAPC0603X33N]
C2  0.01uF  [CAPC0603X33N]
C3  10uF  [FP-GRM188-0_1-e0_2_0_55-IPC_C]
C4  10uF  [FP-GRM188-0_1-e0_2_0_55-IPC_C]
C5  0.1uF  [CAPC0603X33N]
C6  0.1uF  [CAPC0603X33N]
C8  0.1uF  [CAPC0603X33N]
C9  10uF  [CAPC0603X33N]
C10  0.1uF  [CAPC0603X33N]
C11  47uF  [TAYO-JMK212BBJ476MG-T_L]
C12  0.01uF  [CAPC0603X33N]
C13  0.1uF  [FP-GRM188-0_15-MFG]
C14  10uF  [FP-GRM188-0_1-e0_2_0_55-IPC_C]
C15  10uF  [FP-GRM188-0_1-e0_2_0_55-IPC_C]
C16  0.1uF  [CAPC0603X33N]
C17  47uH  [TAYO-JMK212BBJ476MG-T_L]
C18  0.1uF  [CAPC0603X33N]
C19  47uH  [TAYO-JMK212BBJ476MG-T_L]
C20  47uH  [TAYO-JMK212BBJ476MG-T_L]
C21  47uH  [TAYO-JMK212BBJ476MG-T_L]
C22  10uF  [FP-GRM188-0_1-e0_2_0_55-IPC_C]
C23  0.01uF  [CAPC0603X33N]
C24  0.01uF  [CAPC0603X33N]
C25  0.1uF  [CAPC0603X33N]
C26  0.01uF  [CAPC0603X33N]
C27  0.01uF  [CAPC0603X33N]
C28  1uF  [FP-0402-L_1_0_0_05-W_0_5-IPC_B]
C29  1uF  [FP-0402-L_1_0_0_05-W_0_5-IPC_B]
C30  1uF  [FP-0402-L_1_0_0_05-W_0_5-IPC_B]
C31  1uF  [FP-0402-L_1_0_0_05-W_0_5-IPC_B]
C32  10uF  [FP-GRM188-0_1-e0_2_0_55-IPC_C]
C33  0.1uF  [CAPC0603X33N]
C34  1uF  [FP-0402-L_1_0_0_05-W_0_5-IPC_B]
C35  1uF  [FP-0402-L_1_0_0_05-W_0_5-IPC_B]
C36  1uF  [FP-0402-L_1_0_0_05-W_0_5-IPC_B]
C37  1uF  [FP-0402-L_1_0_0_05-W_0_5-IPC_B]
C38  1uF  [FP-0402-L_1_0_0_05-W_0_5-IPC_A]
C39  0.01uF  [CAPC0603X33N]
C40  0.01uF  [CAPC0603X33N]
C41  0.01uF  [CAPC0603X33N]
C42  0.01uF  [CAPC0603X33N]
C43  0.01uF  [CAPC0603X33N]
C44  0.01uF  [CAPC0603X33N]
C45  1uF  [FP-0402-L_1_0_0_05-W_0_5-IPC_A]
C191  0.01uF  [CAPC0603X33N]
C192  1uF  [FP-0402-L_1_0_0_05-W_0_5-IPC_B]
E4  100OHM FERRITE  [TDK-MPZ2012S101A-2_V]
L4  1uH  [XFL4020102MEB]
R1  10  [RESC0603X26X15LL03T05]
R2  27.4K  [2-0402]
R3  46.4K  [1-0201]
R4  17.8K  [2-0402]
R6  10K  value 1K  [RESC1005X35N]
R7  1K  [2-0402]
U1  ADP1754ACPZ-1.3-R7  [QFN65P400X400X80-17N-D]
U3  ADP2164ACPZ-R7  [FP-CP-16-26-IPC_C]
U7  ADP1754ACPZ-1.3-R7  [QFN65P400X400X80-17N-D]

### Nets
GND: C1.2 C2.2 C3.2 C4.2 C5.2 C6.2 C8.2 C9.2 C10.2 C11.2 C12.2 C13.2 C14.2 C15.2 C16.2 C17.2 C18.2 C19.2 C20.2 C21.2 C22.2 C23.2 C24.2 C25.2 C26.2 C27.2 C28.2 C29.2 C30.2 C31.2 C32.2 C33.2 C34.2 C35.2 C36.2 C37.2 C38.2 C39.2 C40.2 C41.2 C42.2 C43.2 C44.2 C45.2 C191.2 C192.2 R2.2 R3.2 U1.6(GND_1) U1.17(GND_2) U3.5(GND) U3.6(PGND) U3.7(PGND) U3.8(PGND) U3.17(EP) U7.6(GND_1) U7.17(GND_2)
1P3_SUPPLY_A: C14.1 C15.1 C16.1 C18.1 C23.1 C24.1 C28.1 C29.1 C34.1 C35.1 C39.1 C40.1 U7.9(SENSE) U7.10(VOUT_1) U7.11(VOUT_2) U7.12(VOUT_3) U7.13(VOUT_4) U7.14(VOUT_5)  [also labelled VDDA_RX_LO, VDDA_RX_TX, VDDA_TX_LO, VDDA_TX_SYNTH]
1P3_SUPPLY_B: C3.1 C4.1 C5.1 C6.1 C26.1 C27.1 C30.1 C31.1 C36.1 C37.1 C41.1 C42.1 C191.1 C192.1 U1.9(SENSE) U1.10(VOUT_1) U1.11(VOUT_2) U1.12(VOUT_3) U1.13(VOUT_4) U1.14(VOUT_5)  [also labelled 1P3_TX1A, 1P3_TX2A, VDDA_BB, VDDA_RX_SYNTH, VDDD_DIG]
1v8: C1.1 C10.1 C22.1 C25.1 E4.1 U1.1(VIN_1) U1.2(VIN_2) U1.3(VIN_3) U1.15(VIN_4) U1.16(VIN_5) U7.1(VIN_1) U7.2(VIN_2) U7.3(VIN_3) U7.15(VIN_4) U7.16(VIN_5)
PG_1P0V: R6.1 U3.16(PGOOD)
PG_1P3V: U1.5(PG) U7.5(PG)
PG_1P35V: U1.4(EN) U7.4(EN)
PWR_CLK: U3.1(SYNC)
VCCPINT: C17.1 C19.1 C20.1 C21.1 L4.2 R7.2
VDD_INTERFACE: C32.1 C33.1 C38.1 C43.1 C44.1 C45.1 E4.2
VIN: C8.1 C9.1 C11.1 R1.2
NetC2_1: C2.1 U1.7(SS)
NetC12_1: C12.1 U7.7(SS)
NetC13_1: C13.1 R1.1 U3.3(TRK) U3.14(VIN) U3.15(EN)
NetL4_1: L4.1 U3.9(SW) U3.10(SW) U3.11(SW)
NetR2_1: R2.1 R4.1 U3.4(FB)
NetR3_1: R3.1 U3.2(RT)
NetR4_2: R4.2 R7.1
NetR6_2: R6.2 U3.12(PVIN) U3.13(PVIN)

Not connected (* = marked no-connect by the designer): U1 8(NC); U7 8(NC)

### Notes on the sheet
- VCC PINT SUPPLY
- 1.3V SUPPLY
- PlutoV2 Schematic
- A
- R.Pender

### Library data of the parts
C1 C5 C6 C8 C10 C16 C18 C25 C33 = GRM033R61C104ME84D: as C52 on sheet ZYNQ JTAG and Decoupling; Package: None; Price: None; Value: *; MP: GRM033R61C104ME84D; Availability: Unavailable
C2 C9 C12 C23 C24 C26 C27 C39-C44 C191 = GRM033R71A103KA01D: as C53 on sheet ZYNQ JTAG and Decoupling; Package: 0603 Taiyo Yuden; MP: GRM033R71A103KA01D; Value: *; SnapEDA_Link: https://www.snapeda.com/parts/GRM033R71A103KA01D/Murata/view-part/4379446/?ref=snap; Availability: Unavailable; Price: None; Check_prices: https://www.snapeda.com/parts/GRM033R71A103KA01D/Murata/view-part/4379446/?ref=eda
C3 C4 C14 C15 C22 C32 = CMP-2006-02792-2: as C155 on sheet RF FRONTEND; Packaging: Tape and Reel; Voltage Rating (DC): 6.3V; Width: 0.031inch; Termination: SMD/SMT; Dielectric: X5R; Package Quantity: 4000; Voltage Rating: 6.3V; Capacitance: 10uF; Case/Package: 0603; Min Operating Temperature: -55°C; Voltage: 6.3V; Length: 1.6mm; Thickness: 0.035inch; Lead Free: Lead Free; Depth: 0.8mm; Case Code (Imperial): 0603; Max Operating Temperature: 85°C; Material: Ceramic; Height: 0.8mm; Tolerance: 20%; Mount: Surface Mount; REACH SVHC: No SVHC; Radiation Hardening: No; Case Code (Metric): 1608
C11 C17 C19-C21 = CMP-2000-06498-1: as C65 on sheet ZYNQ JTAG and Decoupling; Operating Temperature: -55°C~85°C; Mounting Technology: SurfaceMount; Package Reference: 0805; Features: -; Lead Spacing: -; Lead Style: -; Family: CeramicCapacitors; Size / Dimension: 0.079"Lx0.049"W(2.00mmx1.25mm); Package Description: 2-Pin SMD, Body 2.2 x 1.45 mm; Mounting Type: SurfaceMount,MLCC; Package / Case: 0805(2012Metric); Series: M; Category: Capacitors; Packaging: CutTape(CT); Datasheet Version: 10/2015; Datasheet URL: http://datasheet.octopart.com/JMK212BJ476MG-T-Taiyo-Yuden-datasheet-62109412.pdf; Manufacturer URL: http://www.t-yuden.com/; Ratings: -; Height - Seated (Max): -; Standard Package: 1; Thickness (Max): 0.053"(1.35mm); Applications: GeneralPurpose
C13 = CMP-06035-003612-1: as C209 on sheet CONNECTORS_SELECTORS; Tolerance: 20%; Dielectric: X5R; Package Quantity: 4000; Width: 0.8mm; Case/Package: 0603; Thickness: 0.035inch; Capacitance: 10uF; Voltage Rating: 10V; Voltage Rating (DC): 10V; Termination: SMD/SMT; Length: 1.6mm; Lead Free: Lead Free; Mount: Surface Mount; Height: 0.8mm; Depth: 0.8mm; Packaging: Tape and Reel; Weight: 0.000222oz; Min Operating Temperature: -55°C; Case Code (Metric): 1608; Max Operating Temperature: 85°C; Case Code (Imperial): 0603; Material: Ceramic
C28-C31 C34-C38 C45 C192 = CMP-14477-000104-2: None; Tolerance: 10%; Voltage Rating: 16V; Dielectric: X5R; Packaging: Tape and Reel; Depth: 0.5mm; Mount: Surface Mount; Thickness: 0.022inch; Package Quantity: 1; Min Operating Temperature: -55°C; Series: M; Voltage Rating (DC): 16V; Termination: SMD/SMT; Case/Package: 0402; Number of Pins: 2; Case Code (Imperial): 0402; Capacitance: 1uF; Length: 1mm; Halogen Free: Halogen Free; Case Code (Metric): 1005; Width: 0.02inch; RoHS Compliant: Yes; Radiation Hardening: No; Max Operating Temperature: 85°C; Height: 0.5mm; Construction: Flat
E4 = CMP-2000-05399-1: as E1 on sheet ZYNQ JTAG and Decoupling; Package Reference: MPZ2012S101A-2; RoHS: Details; Tolerance: 25%; Operating Temperature Range: -55Cto+125C; Datasheet Version: Jul-13; Dimensions: 1.25mmWx2mmLx0.85mmH; Product: FerriteChipBeads; Termination Style: SMD/SMT; Datasheet URL: http://www.farnell.com/datasheets/1750041.pdf; Factory Pack Quantity: 4000; Brand: TDK; Packaging: Reel; Package Description: 2-Pin Surface Mount Device, Body 2 x 1.25 mm; Product Category: EMIFilterBeads,Chips&Arrays; Manufacturer URL: http://www.tdk.com/; Package / Case: 0805(2012metric)
L4 = XFL4020-102MEB: Inductor; Manufacturer_Name: COILCRAFT; Datasheet Link: https://www.coilcraft.com/getmedia/50632d43-da1b-4cdb-8ab4-3029cab51df3/xfl4020.pdf; Height: 2.1mm; Manufacturer_Part_Number: XFL4020-102MEB
R1 = CMP-2004-03448-1: Manufacturer: Panasonic; Part Number: ERJ1GNF10R0C
R2 R4 R7 = ERJ2RK: as R11 on sheet ZYNQ JTAG and Decoupling; Published: 17-Dec-2003; LatestRevisionDate: 19-Mar-2004; LatestRevisionNote: Silkscreen size reduced.; PackageDocument: Mar-2003; PackageReference: 2-0402; Publisher: Altium Limited; Code_IPC: 1005 [0402]; ComponentLink1Description: Manufacturer Link; ComponentLink1URL: http://www.panasonic.com/industrial/components/resistive_products.htm; ComponentLink2Description: Datasheet; ComponentLink2URL: http://www.panasonic.com/industrial/components/pdf/AOA0000CE2.pdf
R3 = ERJ1GE: Thick Film Chip Resistor, 10 Ohm to 1M Ohm Range, 5% Tolerance, 0201 Size, 0.05 W; Note: If flow soldering, adjust pad width of PCB Footprint to 0.7 - 0.8 times the width of the resistor.; Published: 17-Dec-2003; LatestRevisionDate: 19-Mar-2004; LatestRevisionNote: Silkscreen size reduced.; PackageDocument: Mar-2003; PackageReference: 1-0201; Publisher: Altium Limited; ComponentLink1Description: Manufacturer Link; ComponentLink1URL: http://www.panasonic.com/industrial/components/resistive_products.htm; ComponentLink2Description: Datasheet; ComponentLink2URL: http://www.panasonic.com/industrial/components/pdf/AOA0000CE1.pdf
R6 = Res1: Resistor; Published: 8-Jun-2000; LatestRevisionDate: 17-Jul-2002; LatestRevisionNote: Re-released for DXP Platform.; PackageReference: AXIAL-0.3; Publisher: Altium Limited; PackageDescription: Axial Device, Thru-Hole; 2 Leads; 0.3 in Pin Spacing
U1 U7 = ADP1754ACPZ-1.3-R7: Integrated Circuit; Manufacturer_Name: Analog Devices; Datasheet Link: https://www.analog.com/media/en/technical-documentation/data-sheets/ADP1754_1755.pdf; Height: 0.8mm; Manufacturer_Part_Number: ADP1754ACPZ-1.3-R7
U3 = CMP-09139-000017-1: IC REG BUCK ADJ 4A 16LFCSP; Manufacturer: Analog Devices; Standoff Height: 0.02mm; Max Junction Temp: +125°C; Description: Buck Switching Regulator IC Positive Adjustable 0.6V 1 Output 4A 16-WQFN Exposed Pad, CSP; Max Duty Cycle: 100%; Output Type: AdjustableProgrammable; Switching Frequency: 500-1400kHz; Min Supply Voltage: 2.7V; Max Supply Voltage: 6.5V; Nominal Supply Current: 895uA; Number Of Outputs: 1; Output Voltage: 0.6-6.5V; Switching Topology: Buck; Mouser Description: Dc-Dc Switching Buck Step Down Regulator, Adjustable, 2.7V-6.5Vin, 600Mv-6.5Vout, 4Aout, Lfcsp-16 Rohs Compliant: Yes; Automotive: No; Height: 0.8mm; Temperature Range Low: -40°C; ComponentLink2Description: Datasheet; Octopart: https://octopart.com/adp2164acpz-r7-analog+devices-21054168; Lead Free: Yes; ComponentLink2URL: https://www.analog.com/media/en/technical-documentation/data-sheets/ADP2164.PDF; Category: IC; Output Current: 4A; RoHS: TRUE; Ipc Land Pattern Name: QFN65P400X400X75-16; Device Class L2: Power Management ICs; Package: CP-16-26; Temperature Range High: +125°C; Device Class L1: Integrated Circuits (ICs); Manufacturer Part Number: ADP2164ACPZ-R7; Digikey Description: IC REG BUCK ADJ 4A 16LFCSP; Device Class L3: Voltage Regulators - Switching; Temperature: -40°C to +125°C